# Altium project Flight_Navigation_Controller.PrjPcb
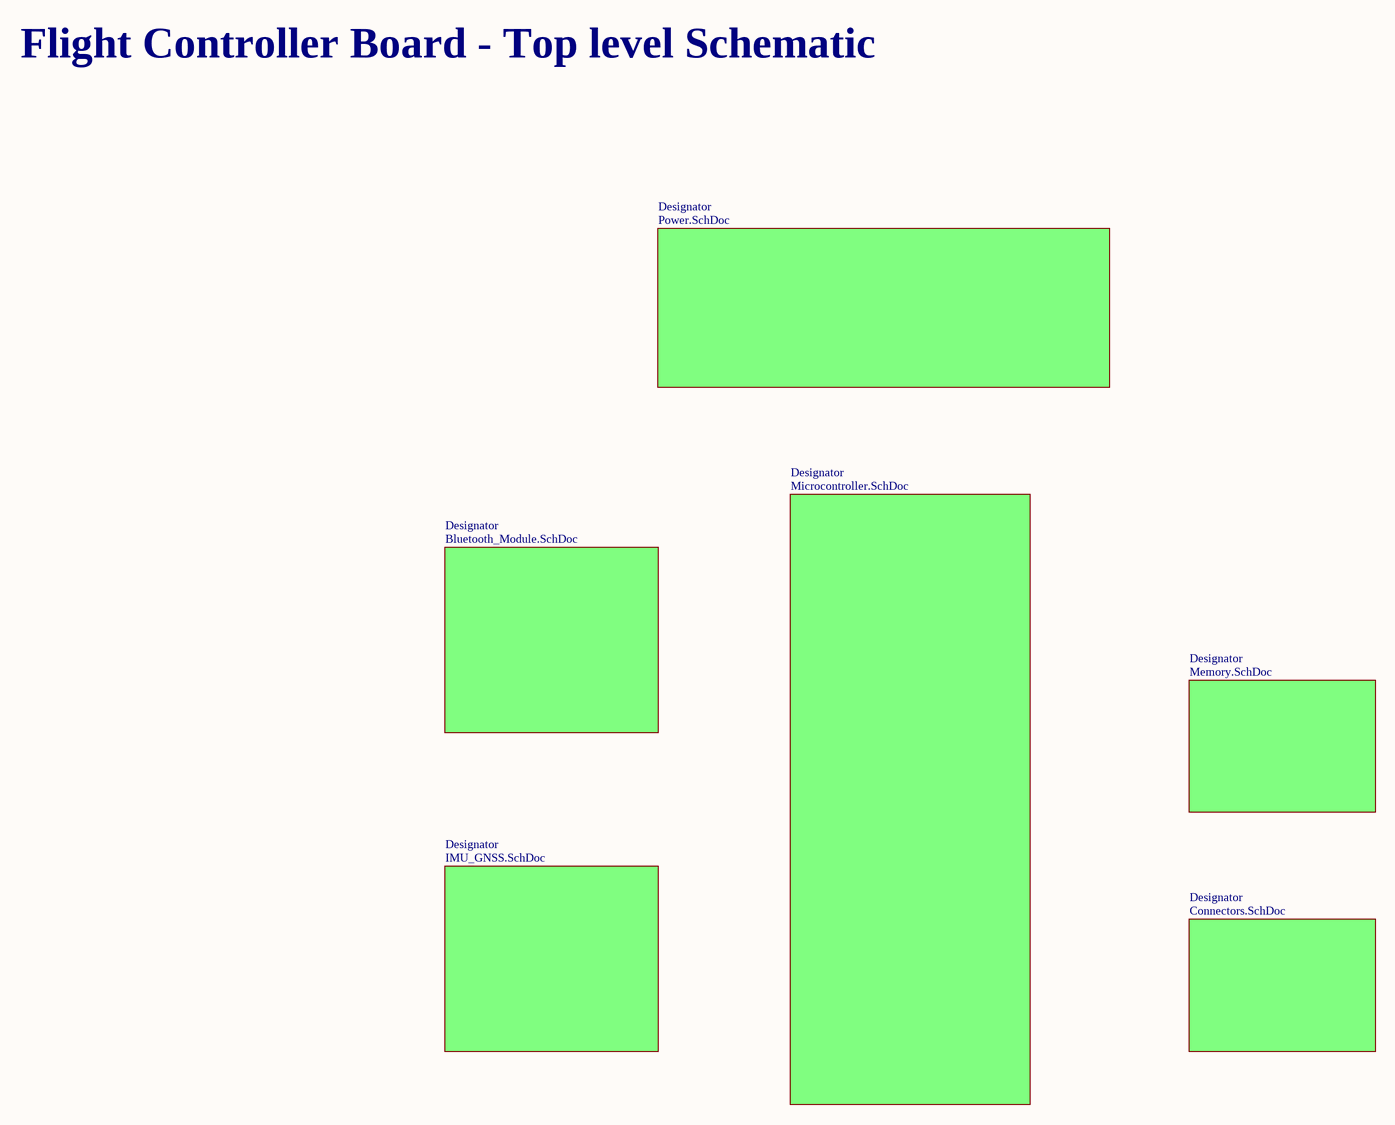
[diagram p0: Hierarchical_Sheet.SchDoc]
7 sheets, 125 parts. Net scope: flat (ports and power ports of the same name join across sheets).
Board files: NAVC_PCB.PcbDoc, Holder.PcbDoc
Sheets:
  Hierarchical_Sheet.SchDoc
    Designator = Microcontroller.SchDoc
    Designator = IMU_GNSS.SchDoc
    Designator = Bluetooth_Module.SchDoc
    Designator = Power.SchDoc
    Designator = Connectors.SchDoc
    Designator = Memory.SchDoc

## Sheet Hierarchical_Sheet.SchDoc
size A3; SheetNumber: 1; SheetTotal: 7

### Sub-sheets
Designator = Microcontroller.SchDoc: no entries
Designator = IMU_GNSS.SchDoc: no entries
Designator = Bluetooth_Module.SchDoc: no entries
Designator = Power.SchDoc: no entries
Designator = Connectors.SchDoc: no entries
Designator = Memory.SchDoc: no entries

### Notes on the sheet
- Flight Controller Board - Top level Schematic

## Sheet Microcontroller.SchDoc
size A3; SheetNumber: 3; SheetTotal: 7
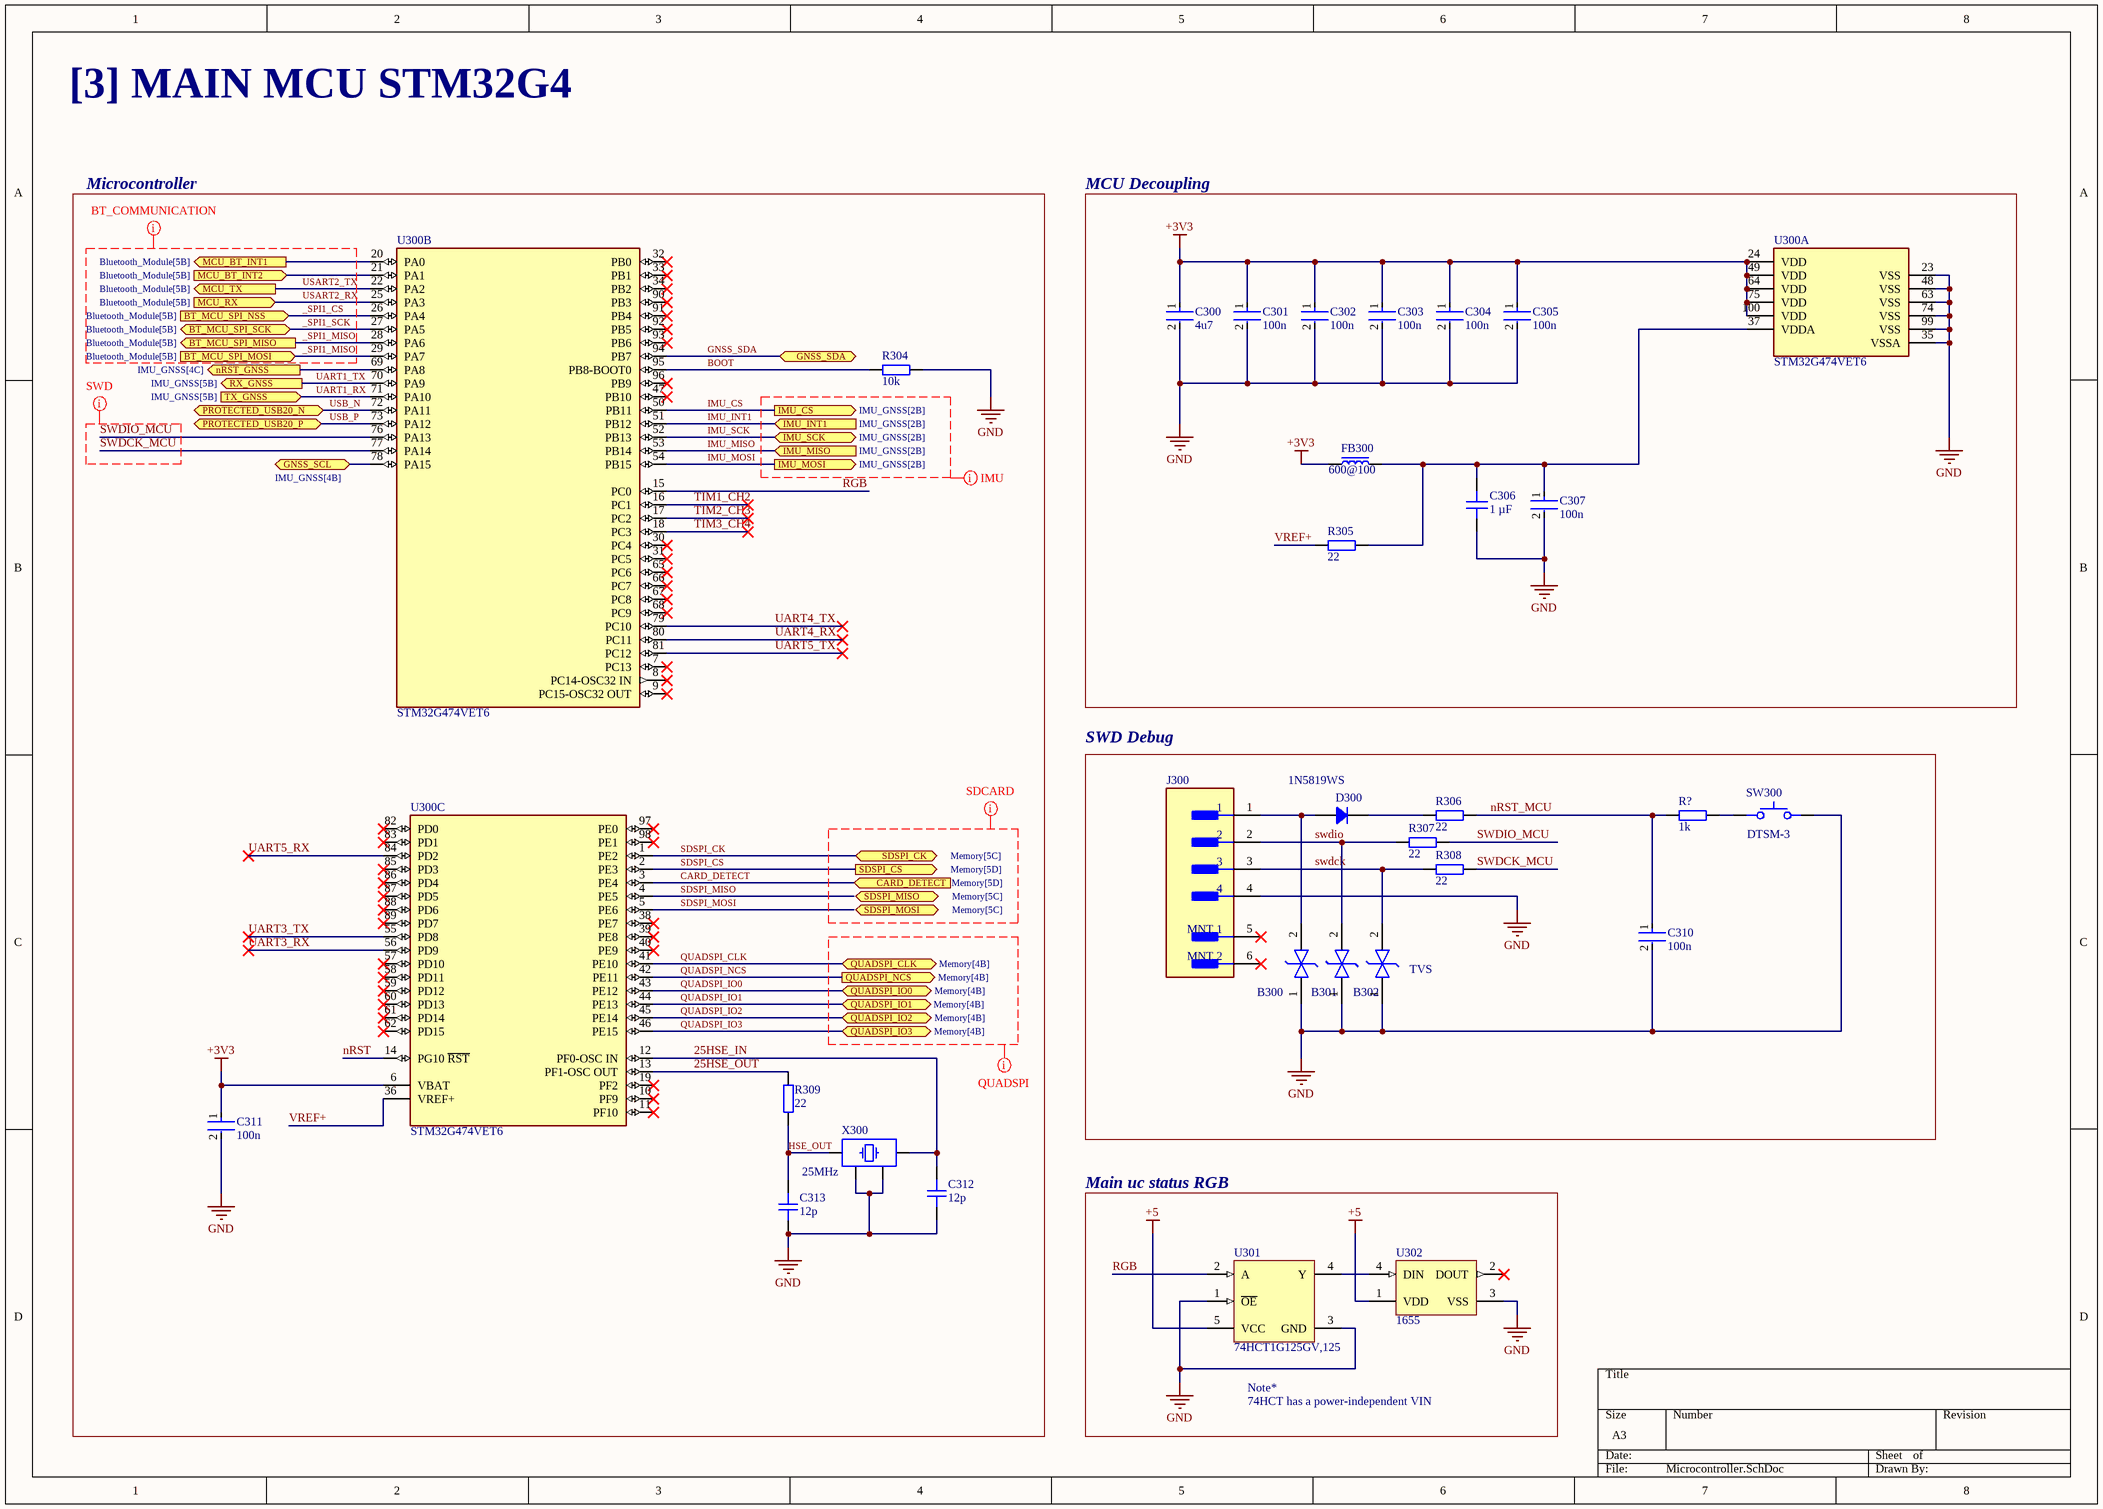
[diagram p1: Microcontroller.SchDoc]

### Parts
(Parts that share a designator on the sheet are numbered #1, #2 ... from top to bottom, then left to right.)
B300  TVS  [SODFL1608X65N]  (value not drawn)
B301  TVS  [SODFL1608X65N]  (value not drawn)
B302  TVS  [SODFL1608X65N]
C300  4u7  [FP-CL10-IPC_C]
C301  100n  [FP-CL779-IPC_C]
C302  100n  [FP-CL779-IPC_C]
C303  100n  [FP-CL779-IPC_C]
C304  100n  [FP-CL779-IPC_C]
C305  100n  [FP-CL779-IPC_C]
C306  1 µF  [CAP 0402_1005]
C307  100n  [FP-CL779-IPC_C]
C310  100n  [FP-CL779-IPC_C]
C311  100n  [FP-CL779-IPC_C]
C312  12p  [CAP_0402]
C313  12p  [CAP_0402]
D300  1N5819WS  [SOD323F]
FB300  600@100  [FB_0603]
J300  S4B-XH-SM4-TB(LF)(SN)  [FP-S4B-XH-SM4-TB_LF_SN-MFG]  (value not drawn)
R304  10k  [RES_0402]
R305  22  [RES_0402]
R306  22  [RES_0402]
R307  22  [RES_0402]
R308  22  [RES_0402]
R309  22  [RES_0402]
R?#1  1k  [RES_0402]
SW300  DTSM-3  [DTSM-3]
U300  STM32G474VET6  [FP-LQFP100-1L-IPC_B]  (parts A,B,C of 3)
U301  74HCT1G125GV,125  [NXP-SOT753_V]
U302  1655  [ADA-RGB-1655_V]
X300  25MHz  [XTAL_3225]

### Blocks framed on the sheet
Microcontroller: C311-C313 R304 R309 U300 X300
MCU Decoupling: C300-C307 FB300 R305 U300
SWD Debug: B300-B302 C310 D300 J300 R306-R308 R?#1 SW300
Main uc status RGB: U301 U302

### Ports
BT_MCU_SPI_MISO (out, see Bluetooth_Module[5B]), BT_MCU_SPI_MOSI (in, see Bluetooth_Module[5B]), BT_MCU_SPI_NSS (in, see Bluetooth_Module[5B]), BT_MCU_SPI_SCK (bidir, see Bluetooth_Module[5B]), CARD_DETECT (in, see Memory[5D]), GNSS_SCL (bidir, see IMU_GNSS[4B]), GNSS_SDA (bidir, see IMU_GNSS[4B]), IMU_CS (out, see IMU_GNSS[2B]), IMU_INT1 (in, see IMU_GNSS[2B]), IMU_MISO (in, see IMU_GNSS[2B]), IMU_MOSI (out, see IMU_GNSS[2B]), IMU_SCK (bidir, see IMU_GNSS[2B]), MCU_BT_INT1 (out, see Bluetooth_Module[5B]), MCU_BT_INT2 (in, see Bluetooth_Module[5B]), MCU_RX (in, see Bluetooth_Module[5B]), MCU_TX (out, see Bluetooth_Module[5B]), nRST_GNSS (out, see IMU_GNSS[4C]), PROTECTED_USB20_N (bidir, see Connectors[2B]), PROTECTED_USB20_P (bidir, see Connectors[2B]), QUADSPI_CLK (bidir, see Memory[4B]), QUADSPI_IO0 (bidir, see Memory[4B]), QUADSPI_IO1 (bidir, see Memory[4B]), QUADSPI_IO2 (bidir, see Memory[4B]), QUADSPI_IO3 (bidir, see Memory[4B]), QUADSPI_NCS (out, see Memory[4B]), RX_GNSS (out, see IMU_GNSS[5B]), SDSPI_CK (bidir, see Memory[5C]), SDSPI_CS (out, see Memory[5D]), SDSPI_MISO (bidir, see Memory[5C]), SDSPI_MOSI (bidir, see Memory[5C]), TX_GNSS (in, see IMU_GNSS[5B])

### Nets
+3V3: C300.1 C301.1 C302.1 C303.1 C304.1 C305.1 C311.1 FB300.1 U300.6(VBAT) U300.24(VDD) U300.49(VDD) U300.64(VDD) U300.75(VDD) U300.100(VDD)
+5: U301.5(VCC) U302.1(VDD)
GND: B300.1(K1) B301.1(K1) B302.1(K1) C300.2 C301.2 C302.2 C303.2 C304.2 C305.2 C306.1 C307.2 C310.2 C311.2 C312.1 C313.1 J300.4 R304.1 SW300.2 U300.23(VSS) U300.35(VSSA) U300.48(VSS) U300.63(VSS) U300.74(VSS) U300.99(VSS) U301.1(~{OE}) U301.3(GND) U302.3(VSS) X300.2 X300.4
25HSE_IN: C312.2 U300.12(PF0-OSC_IN) X300.3
25HSE_OUT: R309.1 U300.13(PF1-OSC_OUT)
_SPI1_CS: U300.26(PA4) ; port BT_MCU_SPI_NSS
_SPI1_MISO: U300.28(PA6) U300.29(PA7) ; port BT_MCU_SPI_MOSI, port BT_MCU_SPI_MISO
_SPI1_SCK: U300.27(PA5) ; port BT_MCU_SPI_SCK
BOOT: R304.2 U300.95(PB8-BOOT0)
CARD_DETECT: U300.3(PE4) ; port CARD_DETECT
GNSS_SDA: U300.94(PB7) ; port GNSS_SDA
HSE_OUT: C313.2 R309.2 X300.1
IMU_CS: U300.50(PB11) ; port IMU_CS
IMU_INT1: U300.51(PB12) ; port IMU_INT1
IMU_MISO: U300.53(PB14) ; port IMU_MISO
IMU_MOSI: U300.54(PB15) ; port IMU_MOSI
IMU_SCK: U300.52(PB13) ; port IMU_SCK
nRST: U300.14(PG10_~{RST})
nRST_MCU: C310.1 R306.1 R?#1.2
QUADSPI_CLK: U300.41(PE10) ; port QUADSPI_CLK
QUADSPI_IO0: U300.43(PE12) ; port QUADSPI_IO0
QUADSPI_IO1: U300.44(PE13) ; port QUADSPI_IO1
QUADSPI_IO2: U300.45(PE14) ; port QUADSPI_IO2
QUADSPI_IO3: U300.46(PE15) ; port QUADSPI_IO3
QUADSPI_NCS: U300.42(PE11) ; port QUADSPI_NCS
RGB: U300.15(PC0) U301.2(A)
SDSPI_CK: U300.1(PE2) ; port SDSPI_CK
SDSPI_CS: U300.2(PE3) ; port SDSPI_CS
SDSPI_MISO: U300.4(PE5)
SDSPI_MOSI: U300.5(PE6)
swdck: B302.2(K2) J300.3 R308.2
SWDCK_MCU: R308.1 U300.77(PA14)
swdio: B301.2(K2) J300.2 R307.2
SWDIO_MCU: R307.1 U300.76(PA13)
TIM1_CH2: U300.16(PC1)
TIM2_CH3: U300.17(PC2)
TIM3_CH4: U300.18(PC3)
UART1_RX: U300.71(PA10) ; port TX_GNSS
UART1_TX: U300.70(PA9) ; port RX_GNSS
UART3_RX: U300.56(PD9)
UART3_TX: U300.55(PD8)
UART4_RX: U300.80(PC11)
UART4_TX: U300.79(PC10)
UART5_RX: U300.84(PD2)
UART5_TX: U300.81(PC12)
USART2_RX: U300.25(PA3) ; port MCU_RX
USART2_TX: U300.22(PA2) ; port MCU_TX
USB_N: U300.72(PA11) ; port PROTECTED_USB20_N  [project net USB20_N]
USB_P: U300.73(PA12) ; port PROTECTED_USB20_P  [project net USB20_P]
VREF+: R305.1 U300.36(VREF+)
NetB300_2: B300.2(K2) D300.1 J300.1
NetB600_9: U300.69(PA8) ; port nRST_GNSS
NetB600_17: U300.78(PA15) ; port GNSS_SCL
NetC306_2: C306.2 C307.1 FB300.2 R305.2 U300.37(VDDA)
NetD300_2: D300.2 R306.2
NetR?#1_1: R?#1.1 SW300.1
NetU300_20: U300.20(PA0) ; port MCU_BT_INT1
NetU300_21: U300.21(PA1) ; port MCU_BT_INT2
NetU301_4: U301.4(Y) U302.4(DIN)

Not connected (* = marked no-connect by the designer): J300 5(MNT_1)* 6(MNT_2)*; U300 7(PC13)* 8(PC14-OSC32_IN)* 9(PC15-OSC32_OUT)* 10(PF9)* 11(PF10)* 19(PF2)* 30(PC4)* 31(PC5)* 32(PB0)* 33(PB1)* 34(PB2)* 38(PE7)* 39(PE8)* 40(PE9)* 47(PB10)* 57(PD10)* 58(PD11)* 59(PD12)* 60(PD13)* 61(PD14)* 62(PD15)* 65(PC6)* 66(PC7)* 67(PC8)* 68(PC9)* 82(PD0)* 83(PD1)* 85(PD3)* 86(PD4)* 87(PD5)* 88(PD6)* 89(PD7)* 90(PB3)* 91(PB4)* 92(PB5)* 93(PB6)* 96(PB9)* 97(PE0)* 98(PE1)*; U302 2(DOUT)*

### Layout directives
net class DEBUG: SWDCK_MCU, SWDIO_MCU
net class QUADSPI: (no net found under the mark)
net class IMU_SPI: (no net found under the mark)
net class BT_MCU_COMMUNICATION: _SPI1_CS, _SPI1_MISO, _SPI1_SCK, USART2_RX, USART2_TX
net class SD: (no net found under the mark)

### Notes on the sheet
- [3] MAIN MCU STM32G4
- Note*
- 74HCT has a power-independent VIN

### Library data of the parts
B300-B302 = PESD5V0S1BB_115: PESD5V0S1BB - Bidirectional ESD protection diode Vbr = 5.5V, Vc; Manufacturer_Name: Nexperia; Manufacturer_Part_Number: PESD5V0S1BB,115; Geometry.Height: 0.65mm; Mouser Part Number: 771-PESD5V0S1BB-T/R; Mouser Price/Stock: https://www.mouser.co.uk/ProductDetail/Nexperia/PESD5V0S1BB115?qs=LOCUfHb8d9vW06zz0pOppQ%3D%3D; Arrow Part Number: PESD5V0S1BB,115; Arrow Price/Stock: https://www.arrow.com/en/products/pesd5v0s1bb115/nexperia; Datasheet Link: https://assets.nexperia.com/documents/data-sheet/PESD5V0S1BB.pdf
C300 = CMP-13271-004224-1: Cap Ceramic 10uF 25V X5R ±20% Pad SMD 0603 +85°C T/R; Width: 0.031inch; Voltage Rating: 25V; Length: 0.063inch; Case Code (Metric): 1608; Dielectric: X5R; Termination: Wraparound; Capacitance: 10uF; Lead Free: Lead Free; Mount: Surface Mount; Package Quantity: 1; Case Code (Imperial): 0603; Thickness: 0.035inch; Packaging: Tape and Reel; Contact Plating: Tin; Min Operating Temperature: -55°C; Tolerance: 20%; Max Operating Temperature: 85°C; Case/Package: 0603
C301-C305 C307 C310 C311 = CMP-13271-002336-1: Cap Ceramic 100nF 50V X7R ±10% SMD 0402 +125°C Paper T/R CL05B104KB54PNC
C306 = CL05A105KA5NQNC: CAP CER 1UF 25V X5R 0402; manufacturer: Samsung Electro-Mechanics; Tolerance: ±10%; Part Number: CL05A105KA5NQNC; Value: 1 µF; Applications: General Purpose; Capacitance: 1 µF; componentlink1description: Datasheet; componentlink1url: http://www.samsungsem.com/kr/support/product-search/mlcc/CL05A105KA5NQNC.jsp; componentlink2description: DigiKey Link; componentlink2url: https://www.digikey.com/en/products/detail/samsung-electro-mechanics/CL05A105KA5NQNC/3887103; Device Package: 0402 (1005 Metric); lastupdated: 26.01.2024 20:04:14; Lifecycle Status: Active; Minimum Order: 1; Mounting Type: Surface Mount, MLCC; Operating Temperature: -55°C ~ 85°C; Package / Case: 0402 (1005 Metric); packaging: TapeAndReel; partid: 8675; Part Status: Active; price: 0.02; series: CL; Size / Dimension: 0.039" L x 0.020" W (1.00mm x 0.50mm); Supplier 1: DigiKey; Supplier Part Number 1: 1276-1445-1-ND; Temperature Coefficient: X5R; Thickness (Max): 0.022" (0.55mm); Voltage - Rated: 25V
C312 C313 = CAP_0402: Capacitor SMD 0402 0402CG120J500NT; Manufacturer: *; Manufacturer Part Number: *; Distributor Link: *; LCSC: *; Rating: *; Dielectric: *
D300 = 1N4148WS: 40V 600mV@1A 1A SOD-323 1N5819WS; Manufacturer: ON Semiconductor; Current - Average Rectified (Io): 150mA; Current - Reverse Leakage @ Vr: 5µA @ 75V; Diode Type: Standard; Reverse Recovery Time (trr): 4ns; Speed: Small Signal =< 200mA (Io), Any Speed; Voltage - DC Reverse (Vr) (Max): 75V; Voltage - Forward (Vf) (Max) @ If: 1V @ 10mA; Part Number: 1N4148WS; ComponentLink1Description: Datasheet; ComponentLink1URL: https://www.onsemi.com/pub/Collateral/1N914BWS-D.pdf; ComponentLink2Description: DigiKey Link; ComponentLink2URL: http://digikey.com/product-detail/en/on-semiconductor/1N4148WS/1N4148WSFSCT-ND/1873821; LastUpdated: 29.01.2024 21:26:23; Lifecycle Status: Active; Minimum Order: 1; Mounting Type: Surface Mount; Operating Temperature - Junction: 150°C (Max); Package / Case: SC-90, SOD-323F; Packaging: TapeAndReel; PartId: 1158; Part Status: Active; Price: 0.03; Series: -; Supplier 1: DigiKey; Supplier Part Number 1: 1N4148WSFSCT-ND; Supplier Device Package: SOD-323F
FB300 = FB_0603: Ferrite Bead SMD 0603 GZ1608D601TF; Manufacturer: *; Manufacturer Part Number: *; Distributor Link: *; LCSC: *
J300 = CMP-17439-000072-1: CONN HEADER SMD R/A 4POS 2.5MM; Number of Positions: 4; Max Current Rating: 3A; Max Voltage Rating (AC): 250V; Connector Type: Male Pin; Contact Resistance: 20mR; Gender: Male; Pitch: 0.098inch; Max Operating Temperature: 85°C; Contact Plating: Tin; Housing Material: Polyamide; Housing Color: Beige; Depth: 10mm; Series: XH; Package Quantity: 1; Length: 15mm; Contact Material: Copper Alloy; Min Operating Temperature: -25°C; REACH SVHC: No SVHC; Orientation: Right Angle; Number of Rows: 1; Contact Type: Male Pin; Color: Natural; Lead Free: Lead Free; Termination: Solder; Mount: Surface Mount; Number of Contacts: 4; Packaging: Tape and Reel
R304-R309 R?#1 = RES_0402: Resistor SMD 0402; Manufacturer: *; Manufacturer Part Number: *; Distributor Link: *; LCSC: *
SW300 = DTSM-3: Tactile Switch SMD SPST; Manufacturer: Diptronics; Manufacturer Part Number: DTSM-3
U300 = CMP-12105-000116-1: IC MCU 32BIT 512KB FLASH 100LQFP; RoHS Compliant: Yes
U301 = CMP-1328-00004-1: High-Speed, Si-Gate CMOS Device, 4.5 to 5.5 V, -40 to 125 degC, 5-Pin SC-74A (SOT753), RoHS, Reel; Manufacturer: NXP Semiconductors; Ci: 1.5 pF Typ.; CPD: 27 pF Typ.; VO: 0 to 5.5 V; PartNumber: 74HCT1G125GV,125; ComponentLink3Description: Package Specification; ComponentLink1URL: http://www.nxp.com/; Temperature Range: -40 to 125 degC; ComponentLink3URL: http://www.nxp.com/documents/outline_drawing/sot753_po.pdf; RoHS: TRUE; Mounting Technology: Surface Mount; PackageVersion: Mar-06; Packing: Reel; ComponentLink2Description: Datasheet; ComponentLink2URL: http://www.nxp.com/documents/data_sheet/74HC_HCT1G125.pdf; PackageDescription: 5-Pin Plastic Surface Mounted Package, Body 2.9 x 1.5 mm, Pitch 0.95 mm; DatasheetVersion: Rev. 05; VCC: 4.5 to 5.5 V; ComponentLink1Description: Manufacturer URL; VI: 0 to 5.5 V
U302 = CMP-2000-05026-1: Intelligent Control LED Integrated Light Source, 3.5 to 5.3 V, -25 to 80 degC, 4-Pin SMD, RoHS, Tape and Reel; Manufacturer: Adafruit-Industries-LLC; Number of LEDs: 10; Configuration: Discrete; Utilized LED: WS2812(5050); Datasheet URL: http://datasheet.octopart.com/ADA1655-Adafruit-Industries-datasheet-32028139.pdf; Series: Neopixel; Interface: -; Package Description: 4-Pin Surface Mount Device, Body 5 x 5 mm; Color: Red,Green,Blue(RGB); Category: Optoelectronics; Controller Type: -; Package Reference: 1655; Manufacturer URL: https://www.adafruit.com/; Mounting Type: SurfaceMount; Datasheet Version: May-13; Size / Dimension: 5.00mmLx5.00mmW; Family: Addressable,Specialty
X300 = TSX-3225_24.0000MF15X-AC: Crystal SMD 24MHz 10PPM 7pF 3225; Manufacturer: Epson; Manufacturer Part Number: TSX-3225 24.0000MF15X-AC

## Sheet IMU_GNSS.SchDoc
size 400 x 200 mm; SheetNumber: 6; SheetTotal: 7
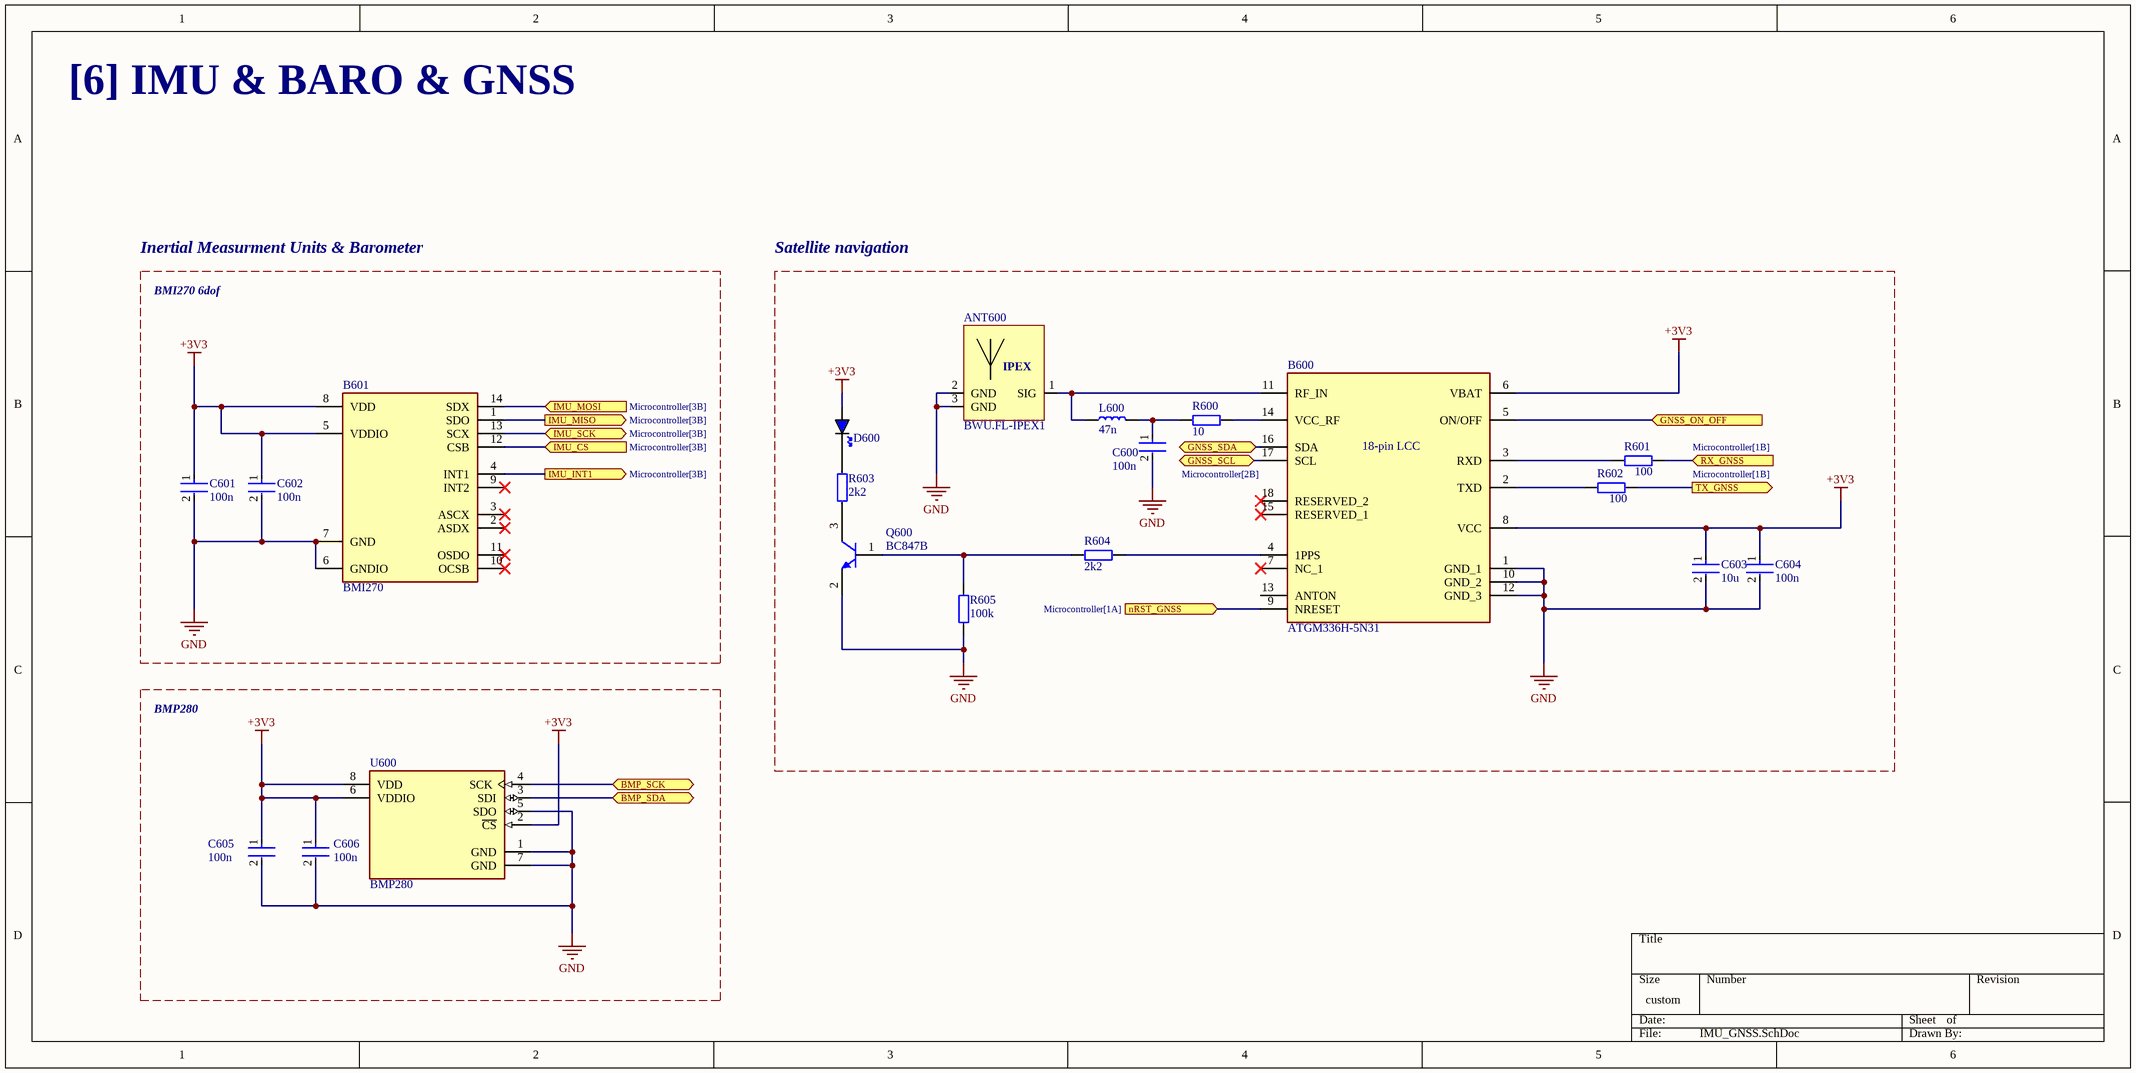
[diagram p2: IMU_GNSS.SchDoc]

### Parts
ANT600  BWU.FL-IPEX1  [BWU.FL-IPEX1]
B600  ATGM336H-5N31  [ATGM336H5N31]
B601  BMI270  [QFN50P300X250X87-14N]
C600  100n  [FP-CL779-IPC_C]
C601  100n  [FP-CL779-IPC_C]
C602  100n  [FP-CL779-IPC_C]
C603  10u  [FP-CL10-IPC_C]
C604  100n  [FP-CL779-IPC_C]
C605  100n  [FP-CL779-IPC_C]
C606  100n  [FP-CL779-IPC_C]
D600  BLUE  [LED_0603_BLUE]  (value not drawn)
L600  47n  [IND_0603]
Q600  BC847B  [INF-SOT23_M]
R600  10  [RES_0603]
R601  100  [RES_0603]
R602  100  [RES_0603]
R603  2k2  [RES_0603]
R604  2k2  [RES_0603]
R605  100k  [RES_0603]
U600  BMP280  [FP-BMP280-MFG]

### Blocks framed on the sheet
Inertial Measurment Units & Barometer: B601 C601 C602
Satellite navigation: ANT600 B600 C600 C603 C604 D600 L600 Q600 R600-R605
BMP280: C605 C606 U600

### Ports
BMP_SCK (bidir), BMP_SDA (bidir), GNSS_ON_OFF (in), GNSS_SCL (bidir, see Microcontroller[2B]), GNSS_SDA (bidir, see Microcontroller[3A]), IMU_CS (in, see Microcontroller[3B]), IMU_INT1 (out, see Microcontroller[3B]), IMU_MISO (out, see Microcontroller[3B]), IMU_MOSI (in, see Microcontroller[3B]), IMU_SCK (bidir, see Microcontroller[3B]), nRST_GNSS (in, see Microcontroller[1A]), RX_GNSS (in, see Microcontroller[1B]), TX_GNSS (out, see Microcontroller[1B])

### Nets
+3V3: B600.6(VBAT) B600.8(VCC) B601.5(VDDIO) B601.8(VDD) C601.1 C602.1 C603.1 C604.1 C605.1 C606.1 D600.A U600.2(~{CS}) U600.6(VDDIO) U600.8(VDD)
GND: ANT600.2(GND) ANT600.3(GND) B600.1(GND_1) B600.10(GND_2) B600.12(GND_3) B601.6(GNDIO) B601.7(GND) C600.2 C601.2 C602.2 C603.2 C604.2 C605.2 C606.2 Q600.2(E) R605.1 U600.1(GND) U600.5(SDO) U600.7(GND)
GNSS_SDA: B600.16(SDA) ; port GNSS_SDA
IMU_CS: B601.12(CSB) ; port IMU_CS
IMU_INT1: B601.4(INT1) ; port IMU_INT1
IMU_MISO: B601.1(SDO) ; port IMU_MISO
IMU_MOSI: B601.14(SDX) ; port IMU_MOSI
IMU_SCK: B601.13(SCX) ; port IMU_SCK
UART1_RX: R602.2 ; port TX_GNSS
UART1_TX: R601.2 ; port RX_GNSS
NetANT600_1: ANT600.1(SIG) B600.11(RF_IN) L600.1
NetB600_2: B600.2(TXD) R602.1
NetB600_3: B600.3(RXD) R601.1
NetB600_4: B600.4(1PPS) R604.2
NetB600_5: B600.5(ON/OFF) ; port GNSS_ON_OFF
NetB600_9: B600.9(NRESET) ; port nRST_GNSS
NetB600_14: B600.14(VCC_RF) R600.2
NetB600_17: B600.17(SCL) ; port GNSS_SCL
NetC600_1: C600.1 L600.2 R600.1
NetD600_K: D600.K R603.2
NetQ600_1: Q600.1(B) R604.1 R605.2
NetQ600_3: Q600.3(C) R603.1
NetU600_3: U600.3(SDI) ; port BMP_SDA
NetU600_4: U600.4(SCK) ; port BMP_SCK

Not connected (* = marked no-connect by the designer): B600 7(NC_1)* 13(ANTON) 15(RESERVED_1)* 18(RESERVED_2)*; B601 2(ASDX)* 3(ASCX)* 9(INT2)* 10(OCSB)* 11(OSDO)*

### Notes on the sheet
- [6] IMU & BARO & GNSS
- BMI270 6dof
- (in symbol ATGM336H-5N31) 18-pin LCC
- (in symbol BWU.FL-IPEX1) IPEX

### Library data of the parts
ANT600 = BWU.FL-IPEX1: IPEX conn Antenna 2.4GHz 50Ohm
B600 = ATGM336H-5N31: GSM & GPRS & GPS Modules 9.7X10.1mm RoHS; Manufacturer_Name: ZHONGKEWEI; Geometry.Height: 2.6mm; Manufacturer_Part_Number: ATGM336H-5N31; Mouser Part Number: *; Mouser Price/Stock: *; Arrow Part Number: *; Arrow Price/Stock: *; Datasheet Link: https://datasheet.lcsc.com/szlcsc/ZHONGKEWEI-ATGM336H-5N31_C90770.pdf
B601 = BMI270: IMUs - Inertial Measurement Units Smart Ultra-Low Power Inertial Measurement Unit (IMU) for Wearable Applications; Manufacturer_Name: BOSCH; Geometry.Height: 0.87mm; Mouser Part Number: 262-BMI270; Mouser Price/Stock: https://www.mouser.co.uk/ProductDetail/Bosch-Sensortec/BMI270?qs=u16ybLDytRYIj%252BjQEee88A%3D%3D; Manufacturer_Part_Number: BMI270; Datasheet Link: https://www.mouser.de/datasheet/2/783/BST-BMI270-FL000-1530947.pdf
C600-C602 C604-C606 = CMP-13271-002336-1: as C301 on sheet Microcontroller
C603 = CMP-13271-004224-1: as C300 on sheet Microcontroller; Width: 0.031inch; Voltage Rating: 25V; Length: 0.063inch; Case Code (Metric): 1608; Dielectric: X5R; Termination: Wraparound; Capacitance: 10uF; Lead Free: Lead Free; Mount: Surface Mount; Package Quantity: 1; Case Code (Imperial): 0603; Thickness: 0.035inch; Packaging: Tape and Reel; Contact Plating: Tin; Min Operating Temperature: -55°C; Tolerance: 20%; Max Operating Temperature: 85°C; Case/Package: 0603
D600 = LED_0603_BLUE: LED 0603 BLUE SMD
L600 = IND_0603: Inductor SMD 0603
Q600 = CMP-1177-00042-1: NPN Silicon AF Transistor, 45 V VCEO, 100 mA IC, SOT23, Reel, Green; Manufacturer: Infineon; VEBO (max): 6Â V; ICBO (max): 15Â nA; VCBO (max): 50Â V; IBM (max): 200Â mA; Green: TRUE; Ptot (max): 330Â mW; fT (typ): 250Â MHz; IC (max): 100Â mA; VCEO (max): 45Â V; PackageDescription: 3-Pin Small Outline Transistor Package, 1.3 x 2.9 mm Body, 0.95 mm Pitch; ComponentLink3URL: http://www.infineon.com/dgdl/SOT23-Package_Overview.pdf?folderId=db3a30431936bc4b0119532290053c66&fileId=db3a30431936bc4b0119533468123c85; PackageVersion: Apr-08; Packing: Reel; ComponentLink3Description: Package Specification; ComponentLink2URL: http://www.infineon.com/dgdl/bc847series_bc848series_bc849series_bc850series.pdf?folderId=db3a304314dca389011541d30fa21656&fileId=db3a304314dca389011541d4630a1657; ComponentLink1URL: http://www.infineon.com/; ComponentLink2Description: Datasheet; Polarity: NPN; Mounting Technology: Surface Mount; PackageReference: SOT23; ICM (max): 200Â mA; ComponentLink1Description: Manufacturer URL; PartNumber: BC847B
R600-R605 = RES_0603: Resistor SMD 0603; Manufacturer: *; Manufacturer Part Number: *; Distributor Link: *; LCSC: *
U600 = CMP-2000-05076-3: SENSOR PRESSURE ABS; Operating Pressure: 15.95PSI; Pressure Type: Absolute; Output Type: SPI; Max Pressure: 290.08PSI; Port Style: No Port; Case/Package: SMD/SMT; Lead Free: Lead Free; Termination: SMD/SMT; Min Operating Temperature: -40°C; Number of Pins: 8; Max Operating Temperature: 85°C

## Sheet Bluetooth_Module.SchDoc
size A3; SheetNumber: 4; SheetTotal: 7
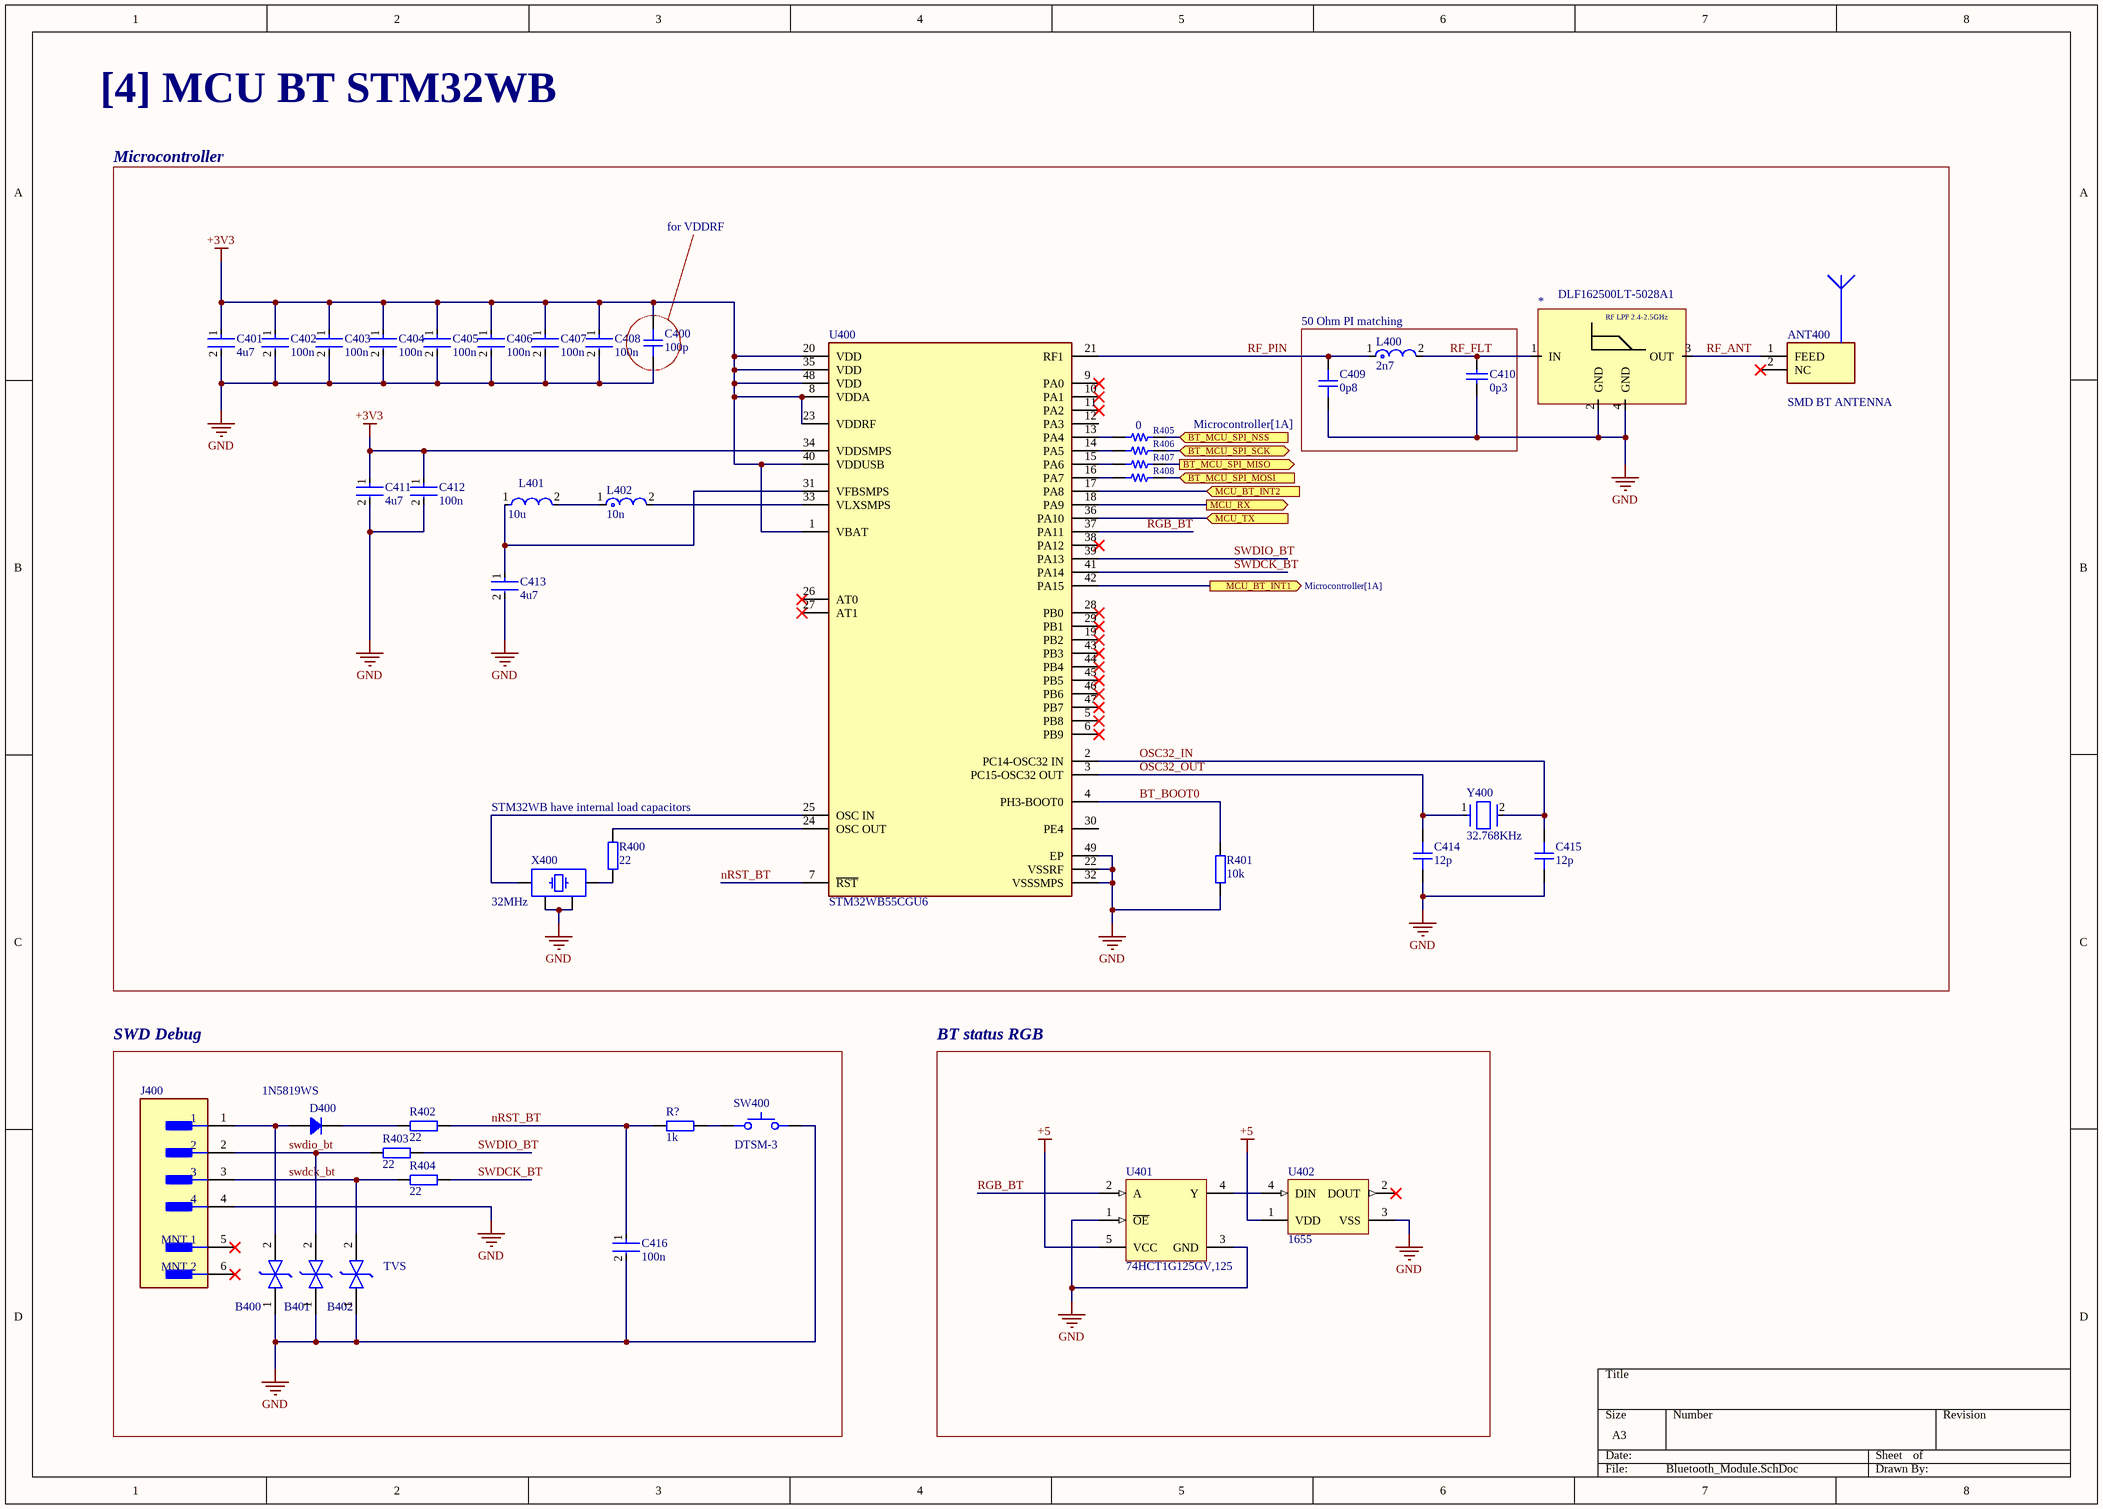
[diagram p3: Bluetooth_Module.SchDoc]

### Parts
(Parts that share a designator on the sheet are numbered #1, #2 ... from top to bottom, then left to right.)
*  DLF162500LT-5028A1  [DLF162500LT-5028A1]
ANT400  SMD BT ANTENNA  [ANTC3216X130N]
B400  TVS  [SODFL1608X65N]  (value not drawn)
B401  TVS  [SODFL1608X65N]  (value not drawn)
B402  TVS  [SODFL1608X65N]
C400  100p  [CAP_0402]
C401  4u7  [FP-CL10-IPC_C]
C402  100n  [FP-CL779-IPC_C]
C403  100n  [FP-CL779-IPC_C]
C404  100n  [FP-CL779-IPC_C]
C405  100n  [FP-CL779-IPC_C]
C406  100n  [FP-CL779-IPC_C]
C407  100n  [FP-CL779-IPC_C]
C408  100n  [FP-CL779-IPC_C]
C409  0p8  [CAP_0402]
C410  0p3  [CAPC1005X55X25NL05T10]
C411  4u7  [FP-CL10-IPC_C]
C412  100n  [FP-CL779-IPC_C]
C413  4u7  [FP-CL10-IPC_C]
C414  12p  [CAP_0402]
C415  12p  [CAP_0402]
C416  100n  [FP-CL779-IPC_C]
D400  1N5819WS  [SOD323F]
J400  S4B-XH-SM4-TB(LF)(SN)  [FP-S4B-XH-SM4-TB_LF_SN-MFG]  (value not drawn)
L400  2n7  [FP-LQG15HH_02-IPC_C]
L401  10u  [FP-LQM21FN_70-MFG]
L402  10n  [FP-LQG15WH_02-MFG]
R400  22  [RES_0402]
R401  10k  [RES_0402]
R402  22  [RES_0402]
R403  22  [RES_0402]
R404  22  [RES_0402]
R405  0  [RES 0402_1005]
R406  0  [RES 0402_1005]  (value not drawn)
R407  0  [RES 0402_1005]  (value not drawn)
R408  0  [RES 0402_1005]  (value not drawn)
R?#2  1k  [RES_0402]
SW400  DTSM-3  [DTSM-3]
U400  STM32WB55CGU6  [FP-STM32WB55CGU6-MFG]
U401  74HCT1G125GV,125  [NXP-SOT753_V]
U402  1655  [ADA-RGB-1655_V]
X400  32MHz  [XTAL_3225]
Y400  32.768KHz  [FP-ABS07AIG-MFG]

### Blocks framed on the sheet
Microcontroller: * ANT400 C400-C408 C411-C415 L401 L402 R400 R401 R405-R408 U400 X400 Y400
50 Ohm PI matching: C409 C410 L400
SWD Debug: B400-B402 C416 D400 J400 R402-R404 R?#2 SW400
BT status RGB: U401 U402

### Ports
BT_MCU_SPI_MISO (out, see Microcontroller[1A]), BT_MCU_SPI_MOSI (in, see Microcontroller[1A]), BT_MCU_SPI_NSS (in, see Microcontroller[1A]), BT_MCU_SPI_SCK (bidir, see Microcontroller[1A]), MCU_BT_INT1 (out, see Microcontroller[1A]), MCU_BT_INT2 (in, see Microcontroller[1A]), MCU_RX (out, see Microcontroller[1A]), MCU_TX (in, see Microcontroller[1A])

### Nets
+3V3: C400.2 C401.1 C402.1 C403.1 C404.1 C405.1 C406.1 C407.1 C408.1 C411.1 C412.1 U400.1(VBAT) U400.8(VDDA) U400.20(VDD) U400.23(VDDRF) U400.34(VDDSMPS) U400.35(VDD) U400.40(VDDUSB) U400.48(VDD)
+5: U401.5(VCC) U402.1(VDD)
GND: *.2(GND) *.4(GND) B400.1(K1) B401.1(K1) B402.1(K1) C400.1 C401.2 C402.2 C403.2 C404.2 C405.2 C406.2 C407.2 C408.2 C409.1 C410.1 C411.2 C412.2 C413.2 C414.1 C415.1 C416.2 J400.4 R401.2 SW400.2 U400.22(VSSRF) U400.32(VSSSMPS) U400.49(EP) U401.1(~{OE}) U401.3(GND) U402.3(VSS) X400.2 X400.4
_SPI1_CS: R405.2 ; port BT_MCU_SPI_NSS
_SPI1_MISO: R407.2 R408.2 ; port BT_MCU_SPI_MOSI, port BT_MCU_SPI_MISO
_SPI1_SCK: R406.2 ; port BT_MCU_SPI_SCK
BT_BOOT0: R401.1 U400.4(PH3-BOOT0)
nRST_BT: C416.1 R402.1 R?#2.2 U400.7(~{RST})
OSC32_IN: C415.2 U400.2(PC14-OSC32_IN) Y400.2
OSC32_OUT: C414.2 U400.3(PC15-OSC32_OUT) Y400.1
RF_ANT: *.3(OUT) ANT400.1(FEED)
RF_FLT: *.1(IN) C410.2 L400.2
RF_PIN: C409.2 L400.1 U400.21(RF1)
RGB_BT: U400.37(PA11) U401.2(A)
SWDCK_BT: B402.2(K2) J400.3 R404.1 R404.2 U400.41(PA14)
SWDIO_BT: B401.2(K2) J400.2 R403.1 R403.2 U400.39(PA13)
USART2_RX: U400.18(PA9) ; port MCU_RX
USART2_TX: U400.36(PA10) ; port MCU_TX
NetB400_2: B400.2(K2) D400.1 J400.1
NetC413_1: C413.1 L401.1 U400.31(VFBSMPS)
NetD400_2: D400.2 R402.2
NetL401_2: L401.2 L402.1
NetL402_2: L402.2 U400.33(VLXSMPS)
NetR400_1: R400.1 U400.24(OSC_OUT)
NetR400_2: R400.2 X400.3
NetR405_1: R405.1 U400.13(PA4)
NetR406_1: R406.1 U400.14(PA5)
NetR407_1: R407.1 U400.15(PA6)
NetR408_1: R408.1 U400.16(PA7)
NetR?#2_1: R?#2.1 SW400.1
NetU300_20: U400.42(PA15) ; port MCU_BT_INT1
NetU300_21: U400.17(PA8) ; port MCU_BT_INT2
NetU400_25: U400.25(OSC_IN) X400.1
NetU401_4: U401.4(Y) U402.4(DIN)

Not connected (* = marked no-connect by the designer): ANT400 2(NC)*; J400 5(MNT_1)* 6(MNT_2)*; U400 5(PB8)* 6(PB9)* 9(PA0)* 10(PA1)* 11(PA2)* 12(PA3) 19(PB2)* 26(AT0)* 27(AT1)* 28(PB0)* 29(PB1)* 30(PE4) 38(PA12)* 43(PB3)* 44(PB4)* 45(PB5)* 46(PB6)* 47(PB7)*; U402 2(DOUT)*

### Notes on the sheet
- [4] MCU BT STM32WB
- for VDDRF
- (near R400) STM32WB have internal load capacitors
- (in symbol DLF162500LT-5028A1) RF LPF 2.4-2.5GHz

### Library data of the parts
ANT400 = RFANT3216120A1T: Antennas 2450+/-50MHz 2.5GHz Fc 2dBi RFANT3216120A1T; Manufacturer_Name: Walsin Technology Corporation; Geometry.Height: 1.3mm; TME Electronic Components Part Number: *; TME Electronic Components Price/Stock: *; Manufacturer_Part_Number: RFANT3216120A1T; Datasheet Link: *
B400-B402 = PESD5V0S1BB_115: as B300 on sheet Microcontroller; Mouser Part Number: 771-PESD5V0S1BB-T/R; Mouser Price/Stock: https://www.mouser.co.uk/ProductDetail/Nexperia/PESD5V0S1BB115?qs=LOCUfHb8d9vW06zz0pOppQ%3D%3D; Arrow Part Number: PESD5V0S1BB,115; Arrow Price/Stock: https://www.arrow.com/en/products/pesd5v0s1bb115/nexperia; Datasheet Link: https://assets.nexperia.com/documents/data-sheet/PESD5V0S1BB.pdf
C400 C409 C414 C415 = CAP_0402: Capacitor SMD 0402; Manufacturer: *; Manufacturer Part Number: *; Distributor Link: *; LCSC: *; Rating: *; Dielectric: *
C401 C411 C413 = CMP-13271-004224-1: as C300 on sheet Microcontroller; Width: 0.031inch; Voltage Rating: 25V; Length: 0.063inch; Case Code (Metric): 1608; Dielectric: X5R; Termination: Wraparound; Capacitance: 10uF; Lead Free: Lead Free; Mount: Surface Mount; Package Quantity: 1; Case Code (Imperial): 0603; Thickness: 0.035inch; Packaging: Tape and Reel; Contact Plating: Tin; Min Operating Temperature: -55°C; Tolerance: 20%; Max Operating Temperature: 85°C; Case/Package: 0603
C402-C408 C412 C416 = CMP-13271-002336-1: as C301 on sheet Microcontroller
C410 = CMP-1034-00007-2: GRM1555C1HR30WA01D; Manufacturer: Murata; Part Number: GRM1555C1HR30WA01D
D400 = 1N4148WS: as D300 on sheet Microcontroller; Part Number: 1N4148WS; ComponentLink1Description: Datasheet; ComponentLink1URL: https://www.onsemi.com/pub/Collateral/1N914BWS-D.pdf; ComponentLink2Description: DigiKey Link; ComponentLink2URL: http://digikey.com/product-detail/en/on-semiconductor/1N4148WS/1N4148WSFSCT-ND/1873821; LastUpdated: 29.01.2024 21:26:23; Lifecycle Status: Active; Minimum Order: 1; Mounting Type: Surface Mount; Operating Temperature - Junction: 150°C (Max); Package / Case: SC-90, SOD-323F; Packaging: TapeAndReel; PartId: 1158; Part Status: Active; Price: 0.03; Series: -; Supplier 1: DigiKey; Supplier Part Number 1: 1N4148WSFSCT-ND; Supplier Device Package: SOD-323F
J400 = CMP-17439-000072-1: as J300 on sheet Microcontroller; Max Operating Temperature: 85°C; Contact Plating: Tin; Housing Material: Polyamide; Housing Color: Beige; Depth: 10mm; Series: XH; Package Quantity: 1; Length: 15mm; Contact Material: Copper Alloy; Min Operating Temperature: -25°C; REACH SVHC: No SVHC; Orientation: Right Angle; Number of Rows: 1; Contact Type: Male Pin; Color: Natural; Lead Free: Lead Free; Termination: Solder; Mount: Surface Mount; Number of Contacts: 4; Packaging: Tape and Reel
L400 = CMP-2000-06580-2: Multilayer type RF Inductor 2.7nH ±0.3nH 0.12Ω 800mA 0402 LQG15HS2N7S02D; Max DC Current: 300mA; Q Factor: 8; Core Material: Air; Test Frequency: 100MHz; Shielding: Unshielded; Self Resonant Frequency: 6GHz; DC Resistance (DCR): 150mR; Packaging: Tape and Reel; Depth: 0.55mm; DC Current: 300mA; Length: 1mm; Current Rating: 300mA; Lead Free: Lead Free; Max Operating Temperature: 125°C; Mount: Surface Mount; Height - Seated (Max): 0.022inch; Case Code (Imperial): 0402; Height: 0.5mm; Termination: SMD/SMT; Package Quantity: 10000; Radiation Hardening: No; Width: 0.5mm; Case Code (Metric): 1005; Min Operating Temperature: -55°C; Military Standard: Not; Case/Package: 0402; Inductance: 2.7nH
L401 = CMP-2000-06587-2: FIXED IND 10UH 100MA 780MOHM SMD LQM21FN100M70L; Shielding: Shielded; Core Material: Ferrite; Self Resonant Frequency: 15MHz; Tolerance: 20%; DC Resistance (DCR): 780mR; Test Frequency: 1MHz; Height: 1.45mm; Package Quantity: 3000; Width: 0.049inch; Inductance: 10uH; Saturation Current: 100mA; Termination: SMD/SMT; Case Code (Metric): 2012; Case/Package: 0805; RoHS Compliant: Yes; Series: LQM21F_70; Max Operating Temperature: 125°C; Lead Free: Lead Free; DC Current: 100mA; Length: 2.2mm; Radiation Hardening: No; Max DC Current: 100mA; Case Code (Imperial): 0805; Packaging: Tape and Reel; Height - Seated (Max): 0.057inch; Rated Current-Max: 100mA; Military Standard: Not; Mount: Surface Mount; Min Operating Temperature: -55°C; Depth: 1.45mm; Current Rating: 100mA
L402 = CMP-06042-005237-1: Multilayer type Inductor for Automotive 10nH ±5% 0.19Ω 500mA 0402 LQG15WZ10NJ02D; Core Material: Air; Test Frequency: 100MHz; DC Resistance (DCR): 190mR; Shielding: Unshielded; Self Resonant Frequency: 3.3GHz; Min Operating Temperature: -55°C; Tolerance: 5%; Inductance: 10nH; Max Operating Temperature: 125°C; Packaging: Cut Tape; Current Rating: 500mA; Case Code (Metric): 1005; Mount: Surface Mount; Case/Package: 0402; Ratings: AEC-Q200; Case Code (Imperial): 0402
R400-R404 R?#2 = RES_0402: Resistor SMD 0402; Manufacturer: *; Manufacturer Part Number: *; Distributor Link: *; LCSC: *
R405-R408 = RP73PF1E249KBTD: RES 249K OHM 0.1% 1/10W 0402; Manufacturer: TE Connectivity Passive Product; Power (Watts): 0.1W, 1/10W; Resistance: 249 kOhms; Temperature Coefficient: ±25ppm/°C; Part Number: RP73PF1E249KBTD; Value: 0; ComponentLink1Description: Datasheet; ComponentLink1URL: https://www.te.com/commerce/DocumentDelivery/DDEController?Action=srchrtrv&DocNm=1773272&DocType=DS&DocLang=English; ComponentLink2Description: DigiKey Link; ComponentLink2URL: https://www.digikey.com/en/products/detail/te-connectivity-passive-product/RP73PF1E249KBTD/8261091; Composition: Thin Film; Device Package: 0402 (1005 Metric); Height - Seated (Max): 0.014" (0.35mm); LastUpdated: 09.02.2024 20:30:24; Lifecycle Status: Active; Minimum Order: 1; Number of Terminations: 2; Operating Temperature: -55°C ~ 155°C; Package / Case: 0402 (1005 Metric); Packaging: TapeAndReel; PartId: 2418; Part Status: Active; Price: 0.07; Series: RP73, Holsworthy; Size / Dimension: 0.039" L x 0.020" W (1.00mm x 0.50mm); Supplier 1: DigiKey; Supplier Part Number 1: A127549CT-ND; Supplier Device Package: 0402; Tolerance: ±0.1%
SW400 = DTSM-3: as SW300 on sheet Microcontroller; Manufacturer Part Number: DTSM-3
U400 = CMP-12105-000013-1: ULTRA-LOW-POWER DUAL CORE ARM CO; Manufacturer: STMicroelectronics; Number Of Cores: 1; Number Of I2C Channels: 2; Interface: I2C,SPI,UART,USART,2-Wire,USB,IrDA,Other; Core Architecture: ARM Cortex-M4; Data Bus Width: 32bits; Memory Size: 1MBytes; Number Of Pwm Channels: 14; Max Supply Voltage: 3.6V; Standoff Height: 0mm; Number Of Timers/Counters: 6; Frequency: 64MHz; Max Junction Temp: +105°C; Number Of I/Os: 30; Min Supply Voltage: 1.71V; Number Of Adc Channels: 13; Ram Size: 256KBytes; Memory Type: FLASH; Octopart: https://octopart.com/stm32wb55cgu6-stmicroelectronics-98750847; Temperature Range High: +105°C; RoHS: TRUE; Number Of Spi Channels: 1; Category: IC; Device Class L1: Integrated Circuits (ICs); Lead Free: Yes; Height: 0.65mm; Number Of A/D Converters: 1; Package: UFQFPN48; Number Of Usb Channels: 1; Number Of Uart Channels: 2; Temperature Range Low: -40°C; Ambient Temperature Range Low: -40°C; Device Class L3: Microcontrollers; Manufacturer Part Number: STM32WB55CGU6; Temperature: -40°C to +105°C; ComponentLink2URL: https://www.st.com/resource/en/datasheet/stm32wb55cg.pdf; Device Class L2: Embedded Processors and Controllers; Digikey Description: ULTRA-LOW-POWER DUAL CORE ARM CO; ComponentLink2Description: Datasheet; Ambient Temperature Range High: +85°C; Automotive: No
U401 = CMP-1328-00004-1: as U301 on sheet Microcontroller; PartNumber: 74HCT1G125GV,125; ComponentLink3Description: Package Specification; ComponentLink1URL: http://www.nxp.com/; Temperature Range: -40 to 125 degC; ComponentLink3URL: http://www.nxp.com/documents/outline_drawing/sot753_po.pdf; RoHS: TRUE; Mounting Technology: Surface Mount; PackageVersion: Mar-06; Packing: Reel; ComponentLink2Description: Datasheet; ComponentLink2URL: http://www.nxp.com/documents/data_sheet/74HC_HCT1G125.pdf; PackageDescription: 5-Pin Plastic Surface Mounted Package, Body 2.9 x 1.5 mm, Pitch 0.95 mm; DatasheetVersion: Rev. 05; VCC: 4.5 to 5.5 V; ComponentLink1Description: Manufacturer URL; VI: 0 to 5.5 V
U402 = CMP-2000-05026-1: as U302 on sheet Microcontroller; Datasheet URL: http://datasheet.octopart.com/ADA1655-Adafruit-Industries-datasheet-32028139.pdf; Series: Neopixel; Interface: -; Package Description: 4-Pin Surface Mount Device, Body 5 x 5 mm; Color: Red,Green,Blue(RGB); Category: Optoelectronics; Controller Type: -; Package Reference: 1655; Manufacturer URL: https://www.adafruit.com/; Mounting Type: SurfaceMount; Datasheet Version: May-13; Size / Dimension: 5.00mmLx5.00mmW; Family: Addressable,Specialty
X400 = TSX-3225_24.0000MF15X-AC: as X300 on sheet Microcontroller
Y400 = CMP-27762-011927-2: CRYSTAL 32.7680KHZ 12.5PF SMD Q13FC1350000400; Frequency Tolerance: 10ppm; ESR (Equivalent Series Resistance): 80kR; Series: ABS07AIG; Packaging: Cut Tape; Ratings: AEC-Q200; Case/Package: SMD/SMT; Max Operating Temperature: 125°C; Min Operating Temperature: -40°C; Width: 0.059inch; Frequency: 32.768kHz; Mount: Surface Mount; Height: 0.035inch; RoHS Compliant: Yes; Length: 0.126inch; Load Capacitance: 12.5pF; Number of Pins: 2

## Sheet Power.SchDoc
size A4; SheetNumber: 2; SheetTotal: 7
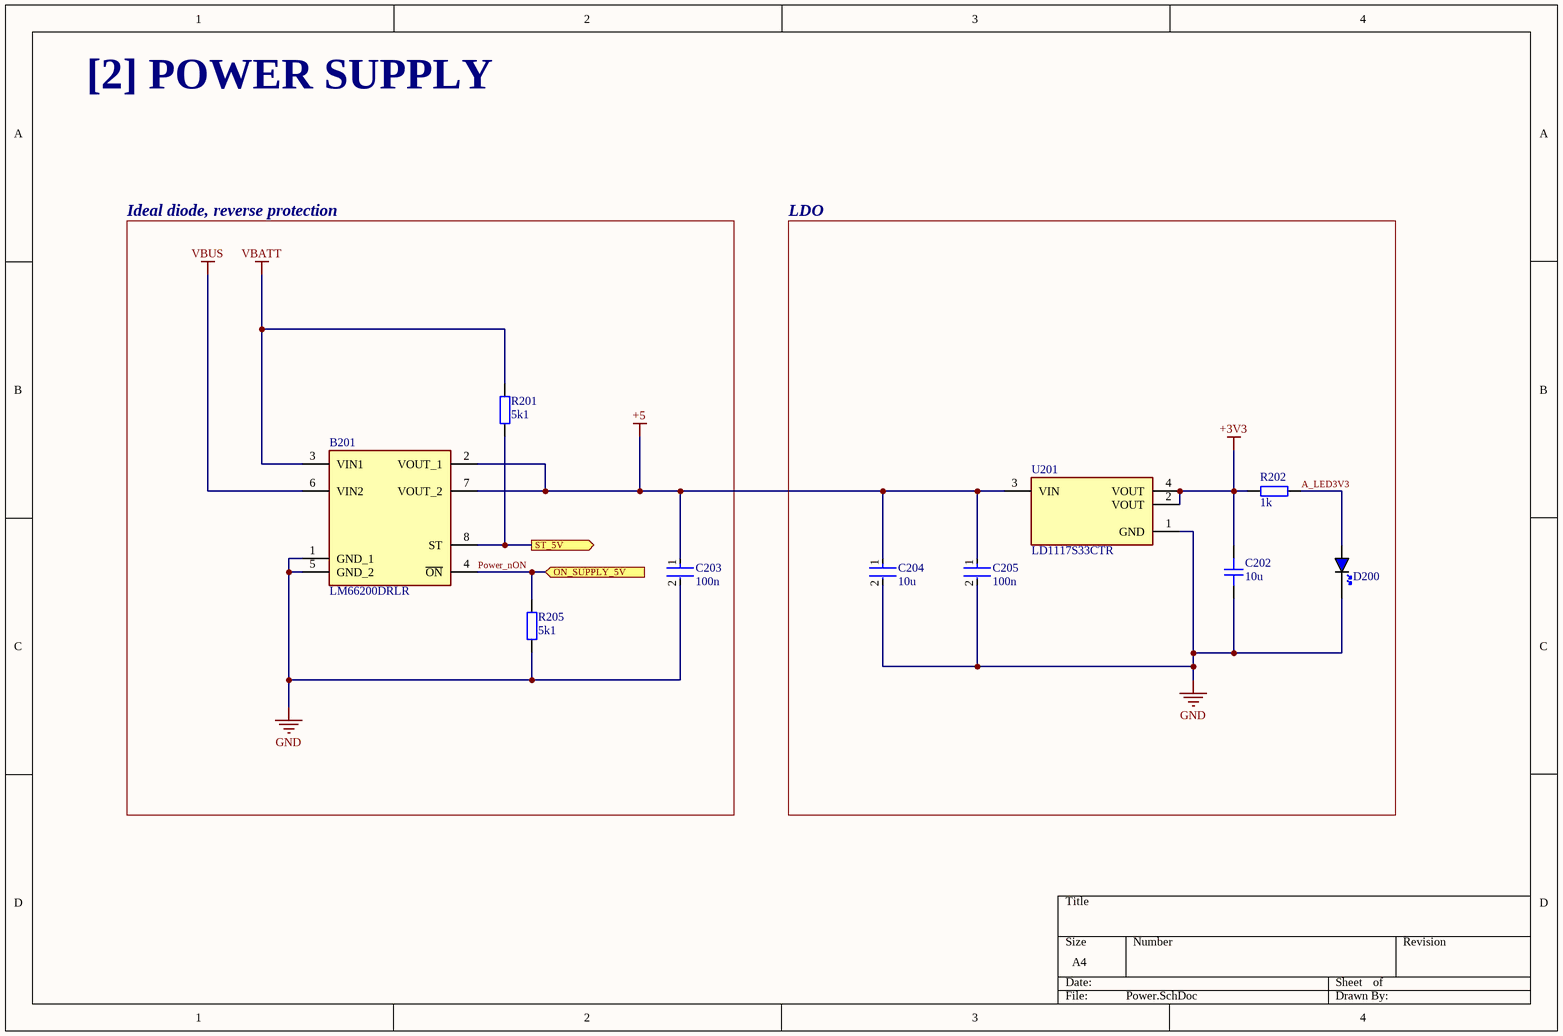
[diagram p4: Power.SchDoc]

### Parts
B201  LM66200DRLR  [SOTFL50P160X60-8N]
C202  10u  [CAP_0603]
C203  100n  [FP-CL779-IPC_C]
C204  10u  [FP-CL10-IPC_C]
C205  100n  [FP-CL779-IPC_C]
D200  BLUE  [LED_0603_BLUE]  (value not drawn)
R201  5k1  [RES_0402]
R202  1k  [RES_0603]
R205  5k1  [RES_0402]
U201  LD1117S33CTR  [FP-SOT-223-0046067_14-MFG]

### Blocks framed on the sheet
Ideal diode, reverse protection: B201 C203 R201 R205
LDO: C202 C204 C205 D200 R202 U201

### Ports
ON_SUPPLY_5V (in), ST_5V (out)

### Nets
+3V3: C202.2 R202.2 U201.2(VOUT) U201.4(VOUT)
+5: B201.2(VOUT_1) B201.7(VOUT_2) C203.1 C204.1 C205.1 U201.3(VIN)
GND: B201.1(GND_1) B201.5(GND_2) C202.1 C203.2 C204.2 C205.2 D200.K R205.2 U201.1(GND)
VBATT: B201.3(VIN1) R201.1
VBUS: B201.6(VIN2)
A_LED3V3: D200.A R202.1
Power_nON: B201.4(~{ON}) R205.1 ; port ON_SUPPLY_5V
NetB201_8: B201.8(ST) R201.2 ; port ST_5V

### Notes on the sheet
- [2] POWER SUPPLY

### Library data of the parts
B201 = LM66200DRLR: 1.6-V to 5.5-V, 40-m, 2.5-A, low-IQ, dual ideal diode; Manufacturer_Name: Texas Instruments; Geometry.Height: 0.6mm; Manufacturer_Part_Number: LM66200DRLR; Mouser Part Number: 595-LM66200DRLR; Mouser Price/Stock: https://www.mouser.co.uk/ProductDetail/Texas-Instruments/LM66200DRLR?qs=Rp5uXu7WBW90hnpZAkIOdQ%3D%3D; Arrow Part Number: LM66200DRLR; Arrow Price/Stock: https://www.arrow.com/en/products/lm66200drlr/texas-instruments?region=nac; Datasheet Link: https://www.ti.com/lit/gpn/lm66200
C202 = CAP_0603: Capacitor SMD 0603; Manufacturer: *; Manufacturer Part Number: *; Distributor Link: *; LCSC: *; Rating: *; Dielectric: *
C203 C205 = CMP-13271-002336-1: as C301 on sheet Microcontroller
C204 = CMP-13271-004224-1: Cap Ceramic 10uF 25V X5R ±20% Pad SMD 0603 +85°C T/R CL10A106MA8NRNC; Width: 0.031inch; Voltage Rating: 25V; Length: 0.063inch; Case Code (Metric): 1608; Dielectric: X5R; Termination: Wraparound; Capacitance: 10uF; Lead Free: Lead Free; Mount: Surface Mount; Package Quantity: 1; Case Code (Imperial): 0603; Thickness: 0.035inch; Packaging: Tape and Reel; Contact Plating: Tin; Min Operating Temperature: -55°C; Tolerance: 20%; Max Operating Temperature: 85°C; Case/Package: 0603
D200 = LED_0603_BLUE: LED 0603 BLUE SMD
R201 R205 = RES_0402: Resistor SMD 0402; Manufacturer: *; Manufacturer Part Number: *; Distributor Link: *; LCSC: *
R202 = RES_0603: Resistor SMD 0603; Manufacturer: *; Manufacturer Part Number: *; Distributor Link: *; LCSC: *
U201 = CMP-0244-00307-2: IC REG LINEAR 3.3V 800MA SOT223; Input Bias Current: 5mA; Output Voltage Accuracy: 1%; Dropout Voltage: 1.1V; Power Dissipation: 12W; Polarity: Positive; Min Input Voltage: 5.3V; Quiescent Current: 10mA; Max Output Current: 1.3A; Output Current: 950mA; Number of Regulators: 1; Max Supply Voltage: 15V; Output Type: Fixed; Output Voltage: 3.3V; Number of Terminals: 4; Min Supply Voltage: 3.3V; Termination: SMD/SMT; Mount: Surface Mount; Max Power Dissipation: 12W; Case/Package: SOT-223; Lead Free: Lead Free; Height: 1.8mm; REACH SVHC: No SVHC; Radiation Hardening: No; Width: 3.5mm; Length: 6.5mm; Packaging: Tape and Reel; Max Input Voltage: 15V; Accuracy: 1%; Weight: 0.01lb; Contact Plating: Tin; Max Operating Temperature: 125°C; Number of Pins: 4; Max Output Voltage: 3.3V; Min Operating Temperature: -40°C; Nominal Output Voltage: 3.3V; Package Quantity: 1; Min Output Voltage: 3.3V; Number of Outputs: 1

## Sheet Connectors.SchDoc
size A4; SheetNumber: 7; SheetTotal: 7
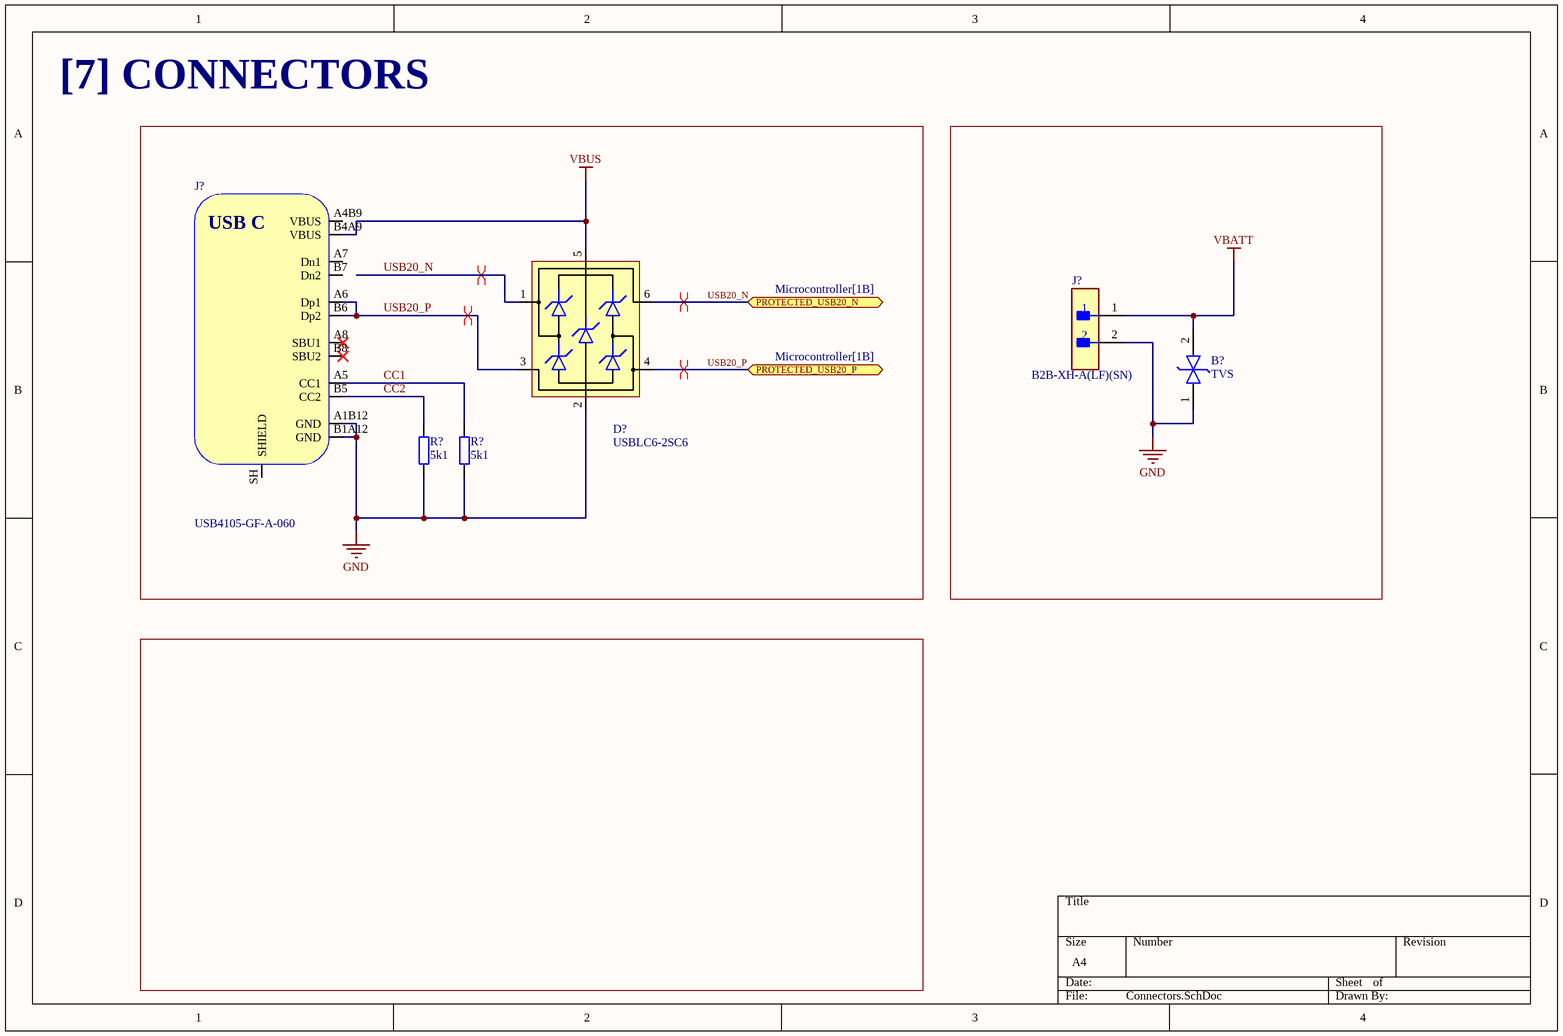
[diagram p5: Connectors.SchDoc]

### Parts
(Parts that share a designator on the sheet are numbered #1, #2 ... from top to bottom, then left to right.)
B?  TVS  [SODFL1608X65N]
D?#1  USBLC6-2SC6  [SOT-23-6]
J?#1  B2B-XH-A(LF)(SN)  [FP-B2B-XH-A_LF_SN-MFG]
J?#2  USB4105-GF-A-060  [USB4105-GF-A-060]
R?#3  5k1  [RES_0402]
R?#4  5k1  [RES_0402]

### Ports
PROTECTED_USB20_N (bidir, see Microcontroller[1B]), PROTECTED_USB20_P (bidir, see Microcontroller[1B])

### Nets
GND: B?.1(K1) D?#1.2(GND) J?#1.2 J?#2.A1B12(GND) J?#2.B1A12(GND) R?#3.2 R?#4.2
VBATT: B?.2(K2) J?#1.1
VBUS: D?#1.5(VBUS) J?#2.B4A9(VBUS)
CC1: J?#2.A5(CC1) R?#4.1
CC2: J?#2.B5(CC2) R?#3.1
USB20_N: D?#1.1(IO1) D?#1.6(IO1) ; port PROTECTED_USB20_N
USB20_P: D?#1.3(IO2) D?#1.4(IO2) J?#2.A6(Dp1) J?#2.B6(Dp2) ; port PROTECTED_USB20_P

Not connected (* = marked no-connect by the designer): J?#2 A4B9(VBUS) A7(Dn1) A8(SBU1)* B7(Dn2) B8(SBU2)* SH(SHIELD)

### Layout directives
differential pair; net class USB_FS: USB20_N, USB20_P

### Notes on the sheet
- [7] CONNECTORS
- (in symbol USB4105-GF-A-060) USB C

### Library data of the parts
B? = PESD5V0S1BB_115: as B300 on sheet Microcontroller; Mouser Part Number: 771-PESD5V0S1BB-T/R; Mouser Price/Stock: https://www.mouser.co.uk/ProductDetail/Nexperia/PESD5V0S1BB115?qs=LOCUfHb8d9vW06zz0pOppQ%3D%3D; Arrow Part Number: PESD5V0S1BB,115; Arrow Price/Stock: https://www.arrow.com/en/products/pesd5v0s1bb115/nexperia; Datasheet Link: https://assets.nexperia.com/documents/data-sheet/PESD5V0S1BB.pdf
D?#1 = USBLC6-2SC6: Low-Capacitance ESD Protection USB; Manufacturer: STMicroelectronics; Manufacturer Part Number: USBLC6-2SC6; Distributor Link: https://www.mouser.de/ProductDetail/STMicroelectronics/USBLC6-2SC6?qs=po45yt2pPpu%2FhNIlwQdTlg%3D%3D
J?#1 = CMP-2000-05888-3: CONN HEADER VERT 2POS 2.5MM; Current Rating: 3A; Voltage Rating: 250V; Number of Contacts: 2; Contact Resistance: 20mR; Wire/Cable Gauge: 22AWG; Insulation Resistance: 1GR; Connector Type: Male Pin; Packaging: Bulk; Contact Material: Brass; Lead Free: Lead Free; Orientation: Straight; Contact Plating: Tin; Max Current Rating: 3A; Termination: Solder; Fastening Type: Detent; Depth: 5.75mm; Housing Material: Polyamide; REACH SVHC: No SVHC; Series: XH; Voltage Rating (AC): 250V; Number of Positions: 2; Color: Natural; Contact Type: Male Pin; Max Voltage Rating (DC): 250V; Pitch: 2.5mm; Lead Pitch: 2.5mm; Mount: Through Hole; Max Operating Temperature: 85°C; Length: 7.4mm; Max Voltage Rating (AC): 250V; Min Operating Temperature: -25°C; Number of Rows: 1; Housing Color: White
J?#2 = USB4105-GF-A-060: USB Connector Type C SMT 12 Pin; Manufacturer: GCT; Manufacturer Part Number: USB4105-GF-A-060; Distributor Link: https://eu.mouser.com/ProductDetail/GCT/USB4105-GF-A-060?qs=QNEnbhJQKvY2mocwNJzgfA%3D%3D
R?#3 R?#4 = RES_0402: Resistor SMD 0402; Manufacturer: *; Manufacturer Part Number: *; Distributor Link: *; LCSC: *

## Sheet Memory.SchDoc
size A3; SheetNumber: 5; SheetTotal: 7
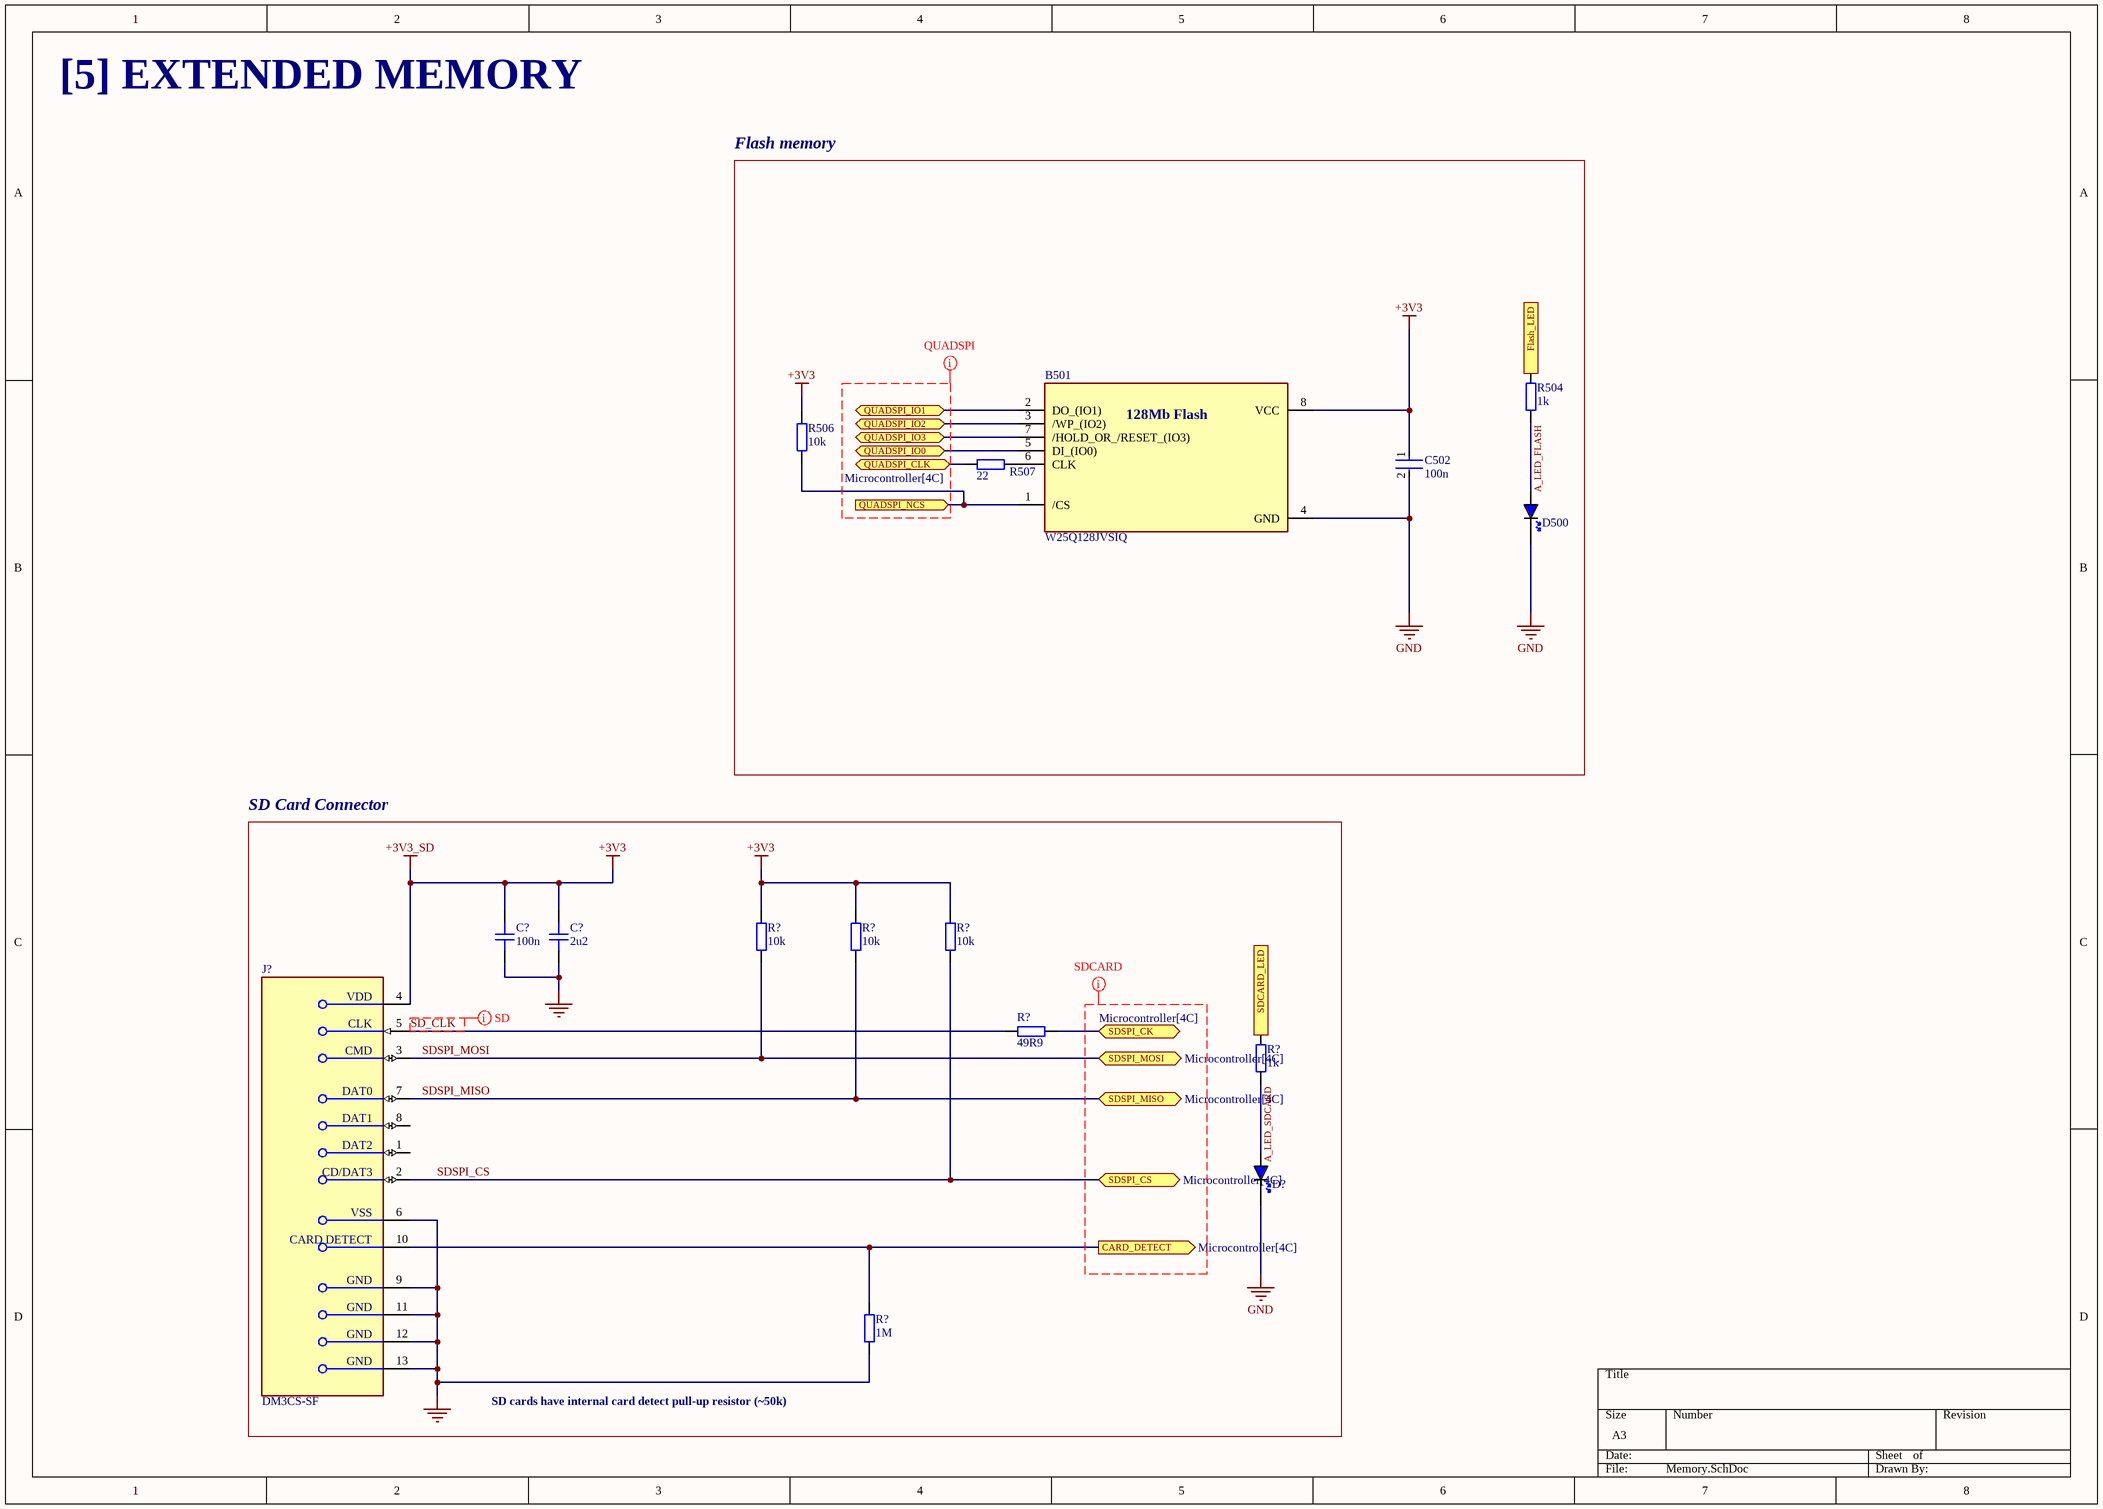
[diagram p6: Memory.SchDoc]

### Parts
(Parts that share a designator on the sheet are numbered #1, #2 ... from top to bottom, then left to right.)
B501  W25Q128JVSIQ  [SOIC127P790X216-8N]
C502  100n  [FP-CL779-IPC_C]
C?#1  100n  [CAP_0402]
C?#2  2u2  [CAP_0603]
D500  BLUE  [LED_0603_BLUE]  (value not drawn)
D?#2  BLUE  [LED_0603_BLUE]  (value not drawn)
J?#3  DM3CS-SF  [FP-DM3CS-SF-MFG]
R504  1k  [RES_0603]
R506  10k  [RES_0402]
R507  22  [RES_0402]
R?#5  10k  [RES_0402]
R?#6  10k  [RES_0402]
R?#7  10k  [RES_0402]
R?#8  49R9  [RES_0402]
R?#9  1k  [RES_0603]
R?#10  1M  [RES_0402]

### Blocks framed on the sheet
Flash memory: B501 C502 D500 R504 R506 R507
SD Card Connector: C?#1 C?#2 D?#2 J?#3 R?#5-R?#10

### Ports
CARD_DETECT (out, see Microcontroller[4C]), Flash_LED (in), QUADSPI_CLK (bidir, see Microcontroller[4C]), QUADSPI_IO0 (bidir, see Microcontroller[4C]), QUADSPI_IO1 (bidir, see Microcontroller[4C]), QUADSPI_IO2 (bidir, see Microcontroller[4C]), QUADSPI_IO3 (bidir, see Microcontroller[4C]), QUADSPI_NCS (in, see Microcontroller[4C]), SDCARD_LED (in), SDSPI_CK (bidir, see Microcontroller[4C]), SDSPI_CS (bidir, see Microcontroller[4C]), SDSPI_MISO (bidir, see Microcontroller[4C]), SDSPI_MOSI (bidir, see Microcontroller[4C])

### Nets
+3V3: B501.8(VCC) C502.1 C?#1.2 C?#2.2 J?#3.4(VDD) R506.1 R?#5.2 R?#6.2 R?#7.2  [also labelled +3V3_SD]
GND: B501.4(GND) C502.2 C?#1.1 C?#2.1 D500.K D?#2.K J?#3.6(VSS) J?#3.9(GND) J?#3.11(GND) J?#3.12(GND) J?#3.13(GND) R?#10.1
A_LED_FLASH: D500.A R504.1
A_LED_SDCARD: D?#2.A R?#9.1
CARD_DETECT: J?#3.10(CARD_DETECT) R?#10.2 ; port CARD_DETECT
QUADSPI_CLK: R507.2 ; port QUADSPI_CLK
QUADSPI_IO0: B501.5(DI_(IO0)) ; port QUADSPI_IO0
QUADSPI_IO1: B501.2(DO_(IO1)) ; port QUADSPI_IO1
QUADSPI_IO2: B501.3(/WP_(IO2)) ; port QUADSPI_IO2
QUADSPI_IO3: B501.7(/HOLD_OR_/RESET_(IO3)) ; port QUADSPI_IO3
QUADSPI_NCS: B501.1(/CS) R506.2 ; port QUADSPI_NCS
SD_CLK: J?#3.5(CLK) R?#8.1
SDSPI_CK: R?#8.2 ; port SDSPI_CK
SDSPI_CS: J?#3.2(CD/DAT3) R?#7.1 ; port SDSPI_CS
SDSPI_MISO: J?#3.7(DAT0) R?#6.1 ; port SDSPI_MISO
SDSPI_MOSI: J?#3.3(CMD) R?#5.1 ; port SDSPI_MOSI
NetB501_6: B501.6(CLK) R507.1

Not connected (* = marked no-connect by the designer): J?#3 1(DAT2) 8(DAT1); R504 2; R?#9 2

### Layout directives
net class QUADSPI: (no net found under the mark)
net class SD: (no net found under the mark), SD_CLK

### Notes on the sheet
- [5] EXTENDED MEMORY
- SD cards have internal card detect pull-up resistor (~50k)
- (in symbol W25Q128JVSIQ) 128Mb Flash

### Library data of the parts
B501 = W25Q128JVSIQ: 128M-bit Serial Flash Memory with uniform 4KB sectors and Dual/Quad SPI; Manufacturer_Name: Winbond; Geometry.Height: 2.16mm; Manufacturer_Part_Number: W25Q128JVSIQ; Mouser Part Number: 454-W25Q128JVSIQ; Mouser Price/Stock: https://www.mouser.co.uk/ProductDetail/Winbond/W25Q128JVSIQ?qs=qSfuJ%252Bfl%2Fd6tLXvPR4fl9w%3D%3D; Arrow Part Number: W25Q128JVSIQ; Arrow Price/Stock: https://www.arrow.com/en/products/w25q128jvsiq/winbond-electronics?region=nac; Datasheet Link: https://www.winbond.com/hq/search-resource-file.jsp?partNo=W25Q128JVSIQ&type=datasheet
C502 = CMP-13271-002336-1: as C301 on sheet Microcontroller
C?#1 = CAP_0402_16V: Capacitor SMD 0402 16V
C?#2 = CAP_0603_16V: Capacitor SMD 0603 16V
D500 D?#2 = LED_0603_BLUE: LED 0603 BLUE SMD
J?#3 = CMP-11597-000003-1: CONN MICRO SD CARD HINGED TYPE; Pitch: 1.1mm; Connector Type: Connector; Current Rating: 500mA; Voltage Rating (AC): 125V; Gender: Female; Insulation Resistance: 1GR; Number of Positions: 8; Contact Resistance: 100mR; Packaging: Tape and Reel; Flammability Rating: UL94 V-0; Lead Free: Lead Free; Min Operating Temperature: -25°C; Orientation: Right Angle; Width: 13.8mm; Number of Rows: 1; Housing Material: Polymer; Package Quantity: 1; Mount: Surface Mount; Max Current Rating: 500mA; Radiation Hardening: No; Max Operating Temperature: 85°C; Contact Plating: Gold; Depth: 1.83mm; Contact Material: Gold; Length: 14.1mm; Number of Contacts: 8; Termination: Solder
R504 R?#9 = RES_0603: Resistor SMD 0603; Manufacturer: *; Manufacturer Part Number: *; Distributor Link: *; LCSC: *
R506 R507 R?#5-R?#8 R?#10 = RES_0402: Resistor SMD 0402
  R506 R507: Manufacturer: *; Manufacturer Part Number: *; Distributor Link: *; LCSC: *

## Nets that join several sheets
+3V3: Microcontroller (14 pins), IMU_GNSS (14 pins), Bluetooth_Module (19 pins), Power (C202.2 R202.2 U201.2 U201.4), Memory (9 pins)
+5: Microcontroller (U301.5 U302.1), Bluetooth_Module (U401.5 U402.1), Power (6 pins)
GND: Microcontroller (29 pins), IMU_GNSS (19 pins), Bluetooth_Module (33 pins), Power (9 pins), Connectors (7 pins), Memory (12 pins)
VBATT: Power (B201.3 R201.1), Connectors (B?.2 J?#1.1)
VBUS: Power (B201.6), Connectors (D?#1.5 J?#2.B4A9)
_SPI1_CS: Microcontroller (U300.26), Bluetooth_Module (R405.2)
_SPI1_MISO: Microcontroller (U300.28 U300.29), Bluetooth_Module (R407.2 R408.2)
_SPI1_SCK: Microcontroller (U300.27), Bluetooth_Module (R406.2)
CARD_DETECT: Microcontroller (U300.3), Memory (J?#3.10 R?#10.2)
GNSS_SDA: Microcontroller (U300.94), IMU_GNSS (B600.16)
IMU_CS: Microcontroller (U300.50), IMU_GNSS (B601.12)
IMU_INT1: Microcontroller (U300.51), IMU_GNSS (B601.4)
IMU_MISO: Microcontroller (U300.53), IMU_GNSS (B601.1)
IMU_MOSI: Microcontroller (U300.54), IMU_GNSS (B601.14)
IMU_SCK: Microcontroller (U300.52), IMU_GNSS (B601.13)
NetB600_9: Microcontroller (U300.69), IMU_GNSS (B600.9)
NetB600_17: Microcontroller (U300.78), IMU_GNSS (B600.17)
NetU300_20: Microcontroller (U300.20), Bluetooth_Module (U400.42)
NetU300_21: Microcontroller (U300.21), Bluetooth_Module (U400.17)
QUADSPI_CLK: Microcontroller (U300.41), Memory (R507.2)
QUADSPI_IO0: Microcontroller (U300.43), Memory (B501.5)
QUADSPI_IO1: Microcontroller (U300.44), Memory (B501.2)
QUADSPI_IO2: Microcontroller (U300.45), Memory (B501.3)
QUADSPI_IO3: Microcontroller (U300.46), Memory (B501.7)
QUADSPI_NCS: Microcontroller (U300.42), Memory (B501.1 R506.2)
SDSPI_CK: Microcontroller (U300.1), Memory (R?#8.2)
SDSPI_CS: Microcontroller (U300.2), Memory (J?#3.2 R?#7.1)
UART1_RX: Microcontroller (U300.71), IMU_GNSS (R602.2)
UART1_TX: Microcontroller (U300.70), IMU_GNSS (R601.2)
USART2_RX: Microcontroller (U300.25), Bluetooth_Module (U400.18)
USART2_TX: Microcontroller (U300.22), Bluetooth_Module (U400.36)
USB20_N: Microcontroller (U300.72), Connectors (D?#1.1 D?#1.6)
USB20_P: Microcontroller (U300.73), Connectors (D?#1.3 D?#1.4 J?#2.A6 J?#2.B6)